# Altium project HAGateWay202205V10.PrjPcb (part 1 of 2)
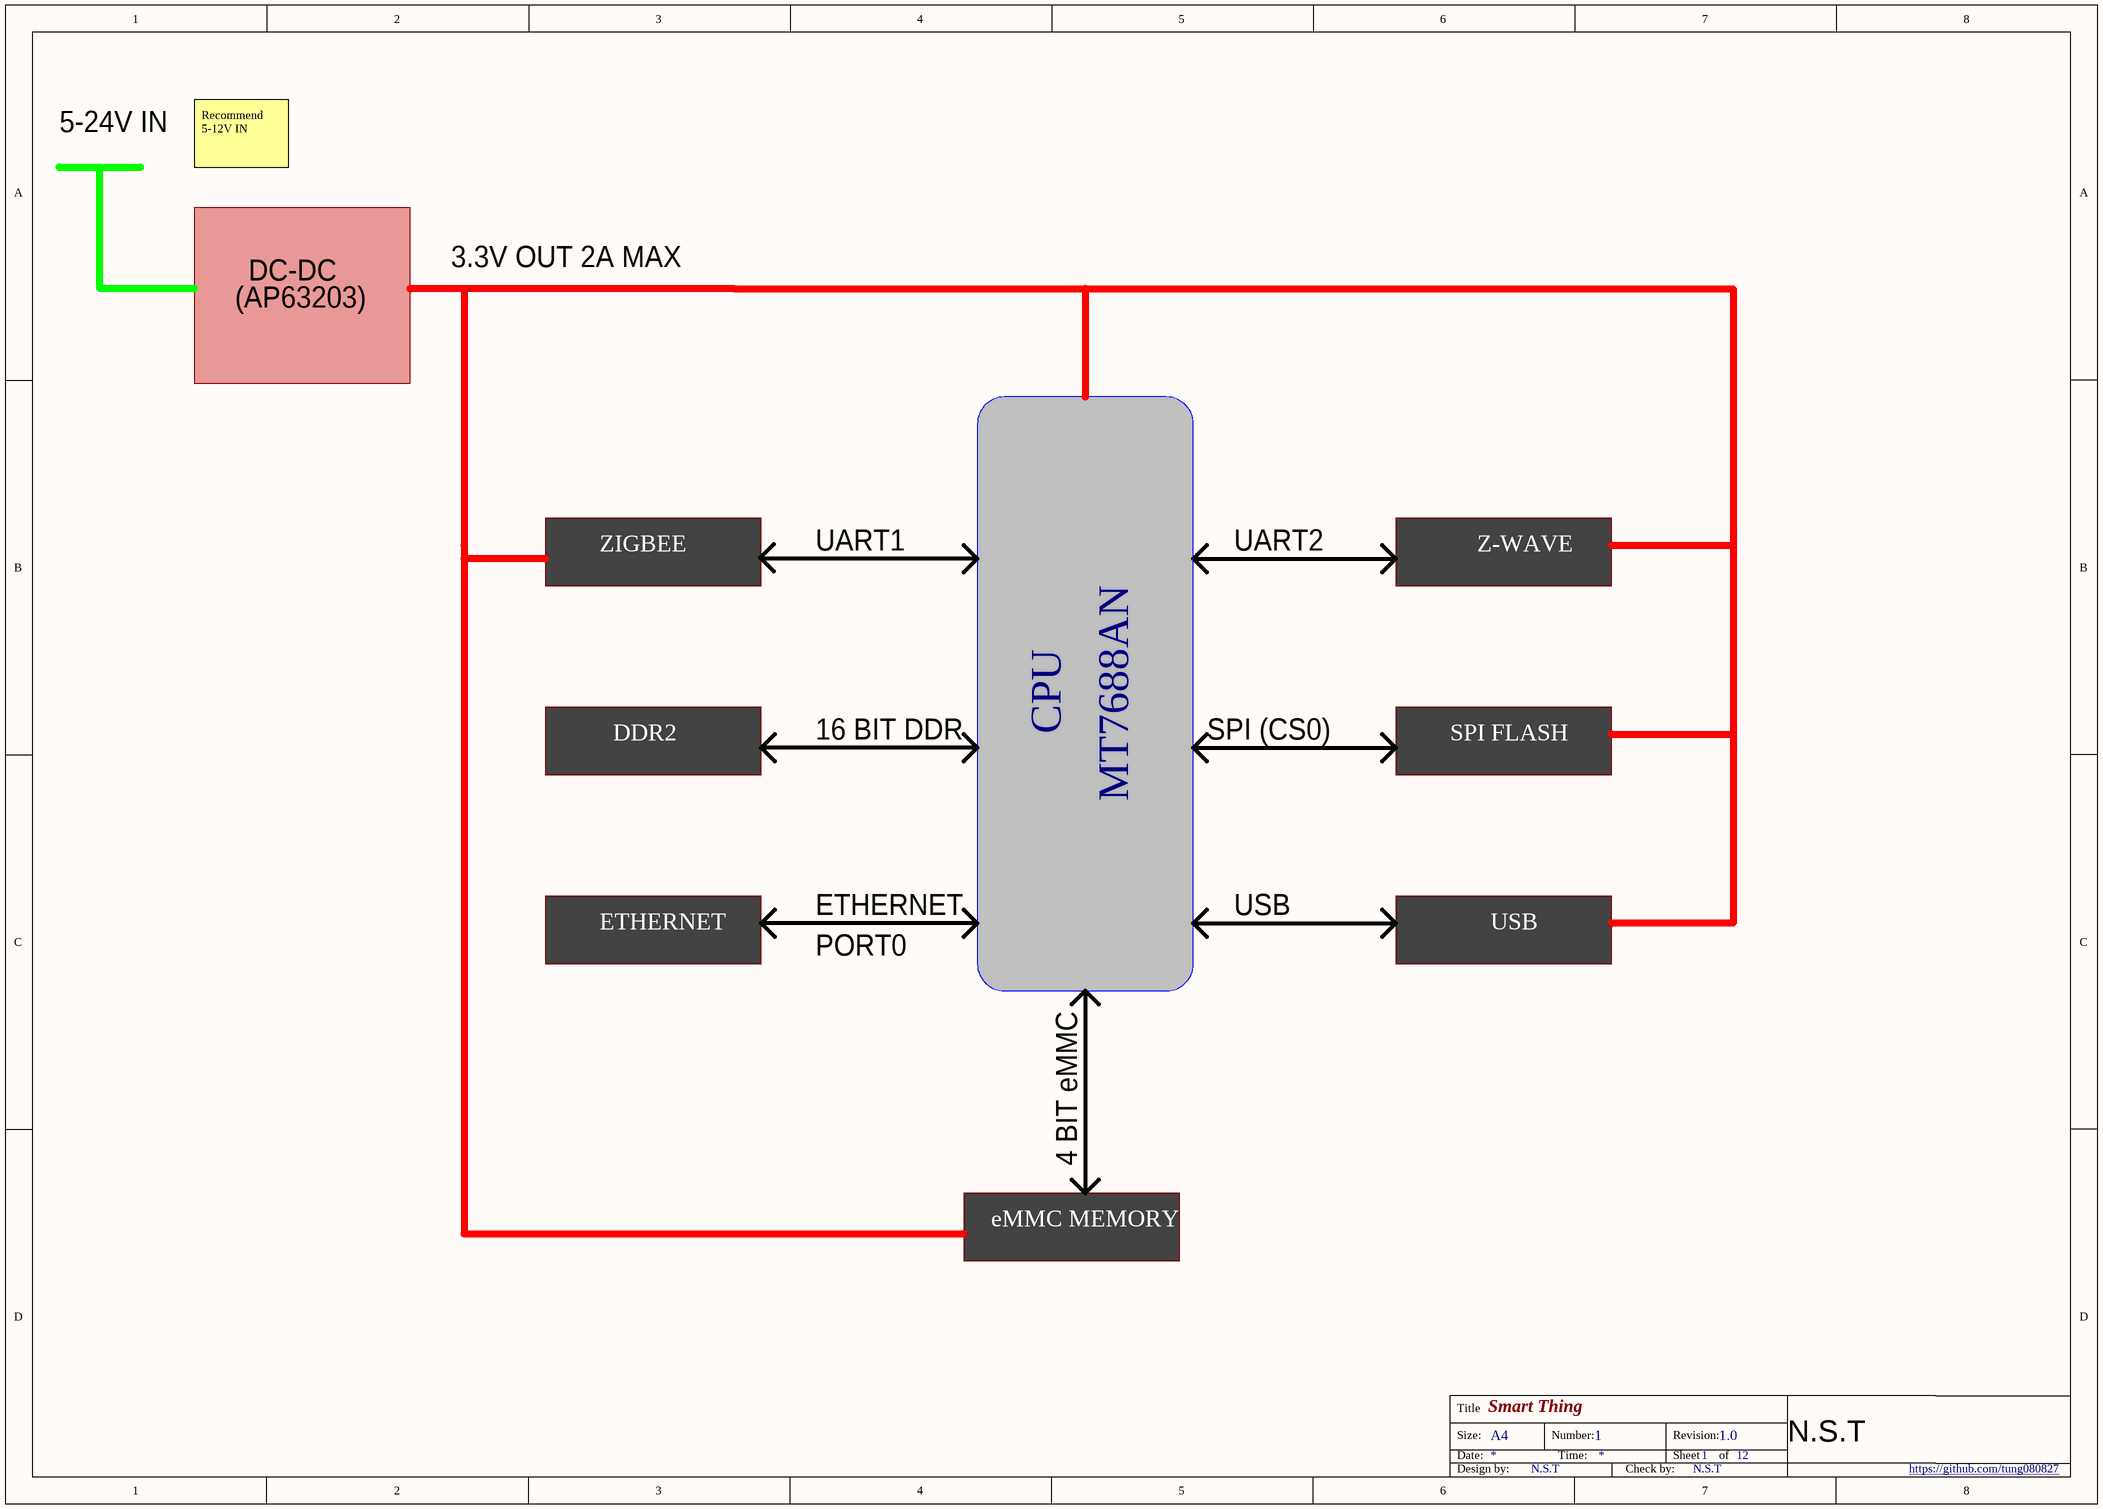
[diagram p0: 01. MAIN.SchDoc]
CheckPerson: N.S.T; DesignPerson: N.S.T; name: Smart Thing; Version: 1.0
12 sheets, 257 parts. Net scope: global (net labels, ports and power ports of the same name join across sheets).
Board file: HAGW202205V10.PcbDoc
Sheets:
  01. MAIN.SchDoc
  02. POWER.SchDoc
  03. ZIGBEE.SchDoc
  04. Z-WAVE.SchDoc
  06. ETHERNET.SchDoc
  05. eMMC.SchDoc
  07. MT7688AN RF Front End.SchDoc
  08. MT7688AN DDR2.SchDoc
  09. MT7688AN Peripheral.SchDoc
  10. MT7688AN USB-PCIe.SchDoc
  11. MT7688AN Ethernet.SchDoc
  12. MT7688AN Power.SchDoc

## Sheet 01. MAIN.SchDoc
size A3; DocumentNumber: 1; SheetNumber: 1; SheetTotal: 12

### Notes on the sheet
- 5-24V IN
- Recommend 5-12V IN
- (AP63203)
- DC-DC
- 3.3V OUT 2A MAX
- ZIGBEE
- UART1
- UART2
- Z-WAVE
- DDR2
- 16 BIT DDR
- CPU
- SPI (CS0)
- SPI FLASH
- MT7688AN
- ETHERNET
- USB
- PORT0
- 4 BIT eMMC
- eMMC MEMORY
- Title
- Size:
- Date:
- A4
- Number:
- Time:
- Revision:
- Sheet
- of
- N.S.T
- Design by:
- Check by:
- https://github.com/tung080827

## Sheet 02. POWER.SchDoc
size A4; DocumentNumber: 2; SheetNumber: 2; SheetTotal: 12
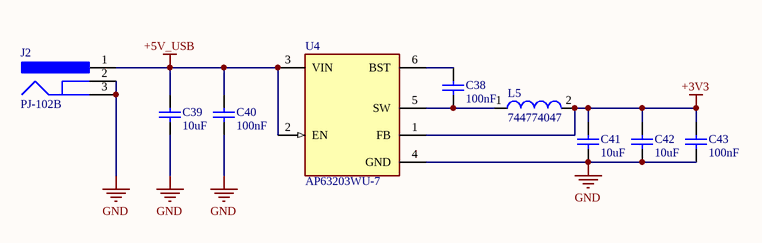
[diagram p1: 02. POWER.SchDoc]

### Parts
C38  100nF  [CAPC1005X56X25NL10T15]
C39  10uF  [CAPC1608X90X35NL10T15]
C40  100nF  [CAPC1005X56X25NL10T15]
C41  10uF  [CAPC1608X90X35NL10T15]
C42  10uF  [CAPC1608X90X35NL10T15]
C43  100nF  [CAPC1005X56X25NL10T15]
J2  PJ-102B  [CUI-PJ-102B_V]
L5  744774047  [WE-PD2-M]
U4  AP63203WU-7  [FP-TSOT26-IPC_B]

### Nets
+3V3: C41.2 C42.2 C43.2 L5.2 U4.1(FB)
+5V_USB: C39.2 C40.2 J2.1 U4.2(EN) U4.3(VIN)
GND: C39.1 C40.1 C41.1 C42.1 C43.1 J2.2 J2.3 U4.4(GND)
NetC38_1: C38.1 L5.1 U4.5(SW)
NetC38_2: C38.2 U4.6(BST)

### Notes on the sheet
- Title
- Size:
- Date:
- A4
- Number:
- Time:
- Revision:
- Sheet
- of
- N.S.T
- Design by:
- Check by:
- https://github.com/tung080827

### Library data of the parts
C38 C40 C43 = CMP-2008-02743-1: Manufacturer: AVX Interconnect / Elco; Part Number: 04026D104KAT2A
C39 C41 C42 = CMP-2006-02354-1: Manufacturer: Murata; Part Number: GCM188R70J225KE22D
J2 = CMP-2000-06900-1: Through Hole Right Angle DC Power Jack, 2.5 A, 2.5 mm Center Pin, 3 Position, -25 to 85 degC, RoHS, Bulk; Manufacturer: CUIInc.; Insulation Resistance: 100MOhms; Inside Contact Diameter: 2.5mm; Outside Contact Diameter: 6.5mm; Voltage Rating: 24V; Current Rating: 2.5A; Brand: CUI; Datasheet URL: http://www.cui.com/product/resource/pj-102b.pdf; Housing Material: PolybutyleneTerephthalate(PBT); Operating Temperature Range: -25Cto+85C; Package Reference: PJ-102B; Factory Pack Quantity: 280; RoHS: True; Contact Material: Copper; Datasheet Version: Rev. 1.03, 04/2016; Product: Jacks; Mounting Angle: Right; Mounting Style: ThroughHole; Flammability Rating: UL94V-0; Product Category: DCPowerConnectors; Contact Gender: Male; Termination Style: ThroughHole; Manufacturer URL: http://www.cui.com/; Mounting Technology: ThroughHole; Package Description: 3-Pin Through Hole Device, Body 14.4 x 9 mm, Height 11 mm; Contact Plating: Nickel; Packaging: Bulk; Connector Type: DCPowerJack
L5 = CMP-0227-00442-1: SMD Power Inductor WE-PD2, L = 4.70 µH; Inductance: 4.70 ÂµH; PackageVersion: 2005; PackageDescription: SMD Inductor, 2-Leads, Body 5.8 x 5.2 mm; ComponentLink2URL: http://www.we-online.de/katalog/media/pdf/744774047.pdf; ComponentLink1Description: Manufacturer Link; PackageReference: WE-PD2-M; DatasheetVersion: ver 2, Jun-2005; ComponentLink1URL: http://www.we-online.com; ComponentLink2Description: Datasheet
U4 = CMP-12757-000006-1: IC REG BUCK 3.3V 2A TSOT26; Manufacturer: Diodes Inc.; Output Type: Fixed; Min Supply Voltage: 3.8V; Number Of Outputs: 1; Max Junction Temp: +160°C; Nominal Supply Current: 22uA; Standoff Height: 0.01mm; Switching Frequency: 1.1MHz; Max Supply Voltage: 32V; ComponentLink2Description: Datasheet; Device Class L1: Integrated Circuits (ICs); Temperature: to +160°C; Device Class L3: Voltage Regulators - Switching; RoHS: TRUE; Octopart: https://octopart.com/ap63203wu-7-diodes+inc.-98099550; Output Voltage: 3.3V; Lead Free: Yes; ComponentLink2URL: https://www.diodes.com/assets/Datasheets/AP63200-AP63201-AP63203-AP63205.pdf; Digikey Description: IC REG BUCK 3.3V 2A TSOT26; Footprint Url: https://www.diodes.com/assets/Package-Files/TSOT26.pdf; Ambient Temperature Range High: +85°C; Height: 1mm; Automotive: No; Temperature Range High: +160°C; Switching Topology: Buck; Output Current: 2A; Package: TSOT26; Category: IC; Mouser Description: AP63203 Series 3.3 V 2 A SMT Fixed Low IQ Synchronous Buck - TSOT-26; Device Class L2: Power Management ICs; Ambient Temperature Range Low: -40°C; Manufacturer Part Number: AP63203WU-7

## Sheet 03. ZIGBEE.SchDoc
size A3; DocumentNumber: 3; SheetNumber: 3; SheetTotal: 12
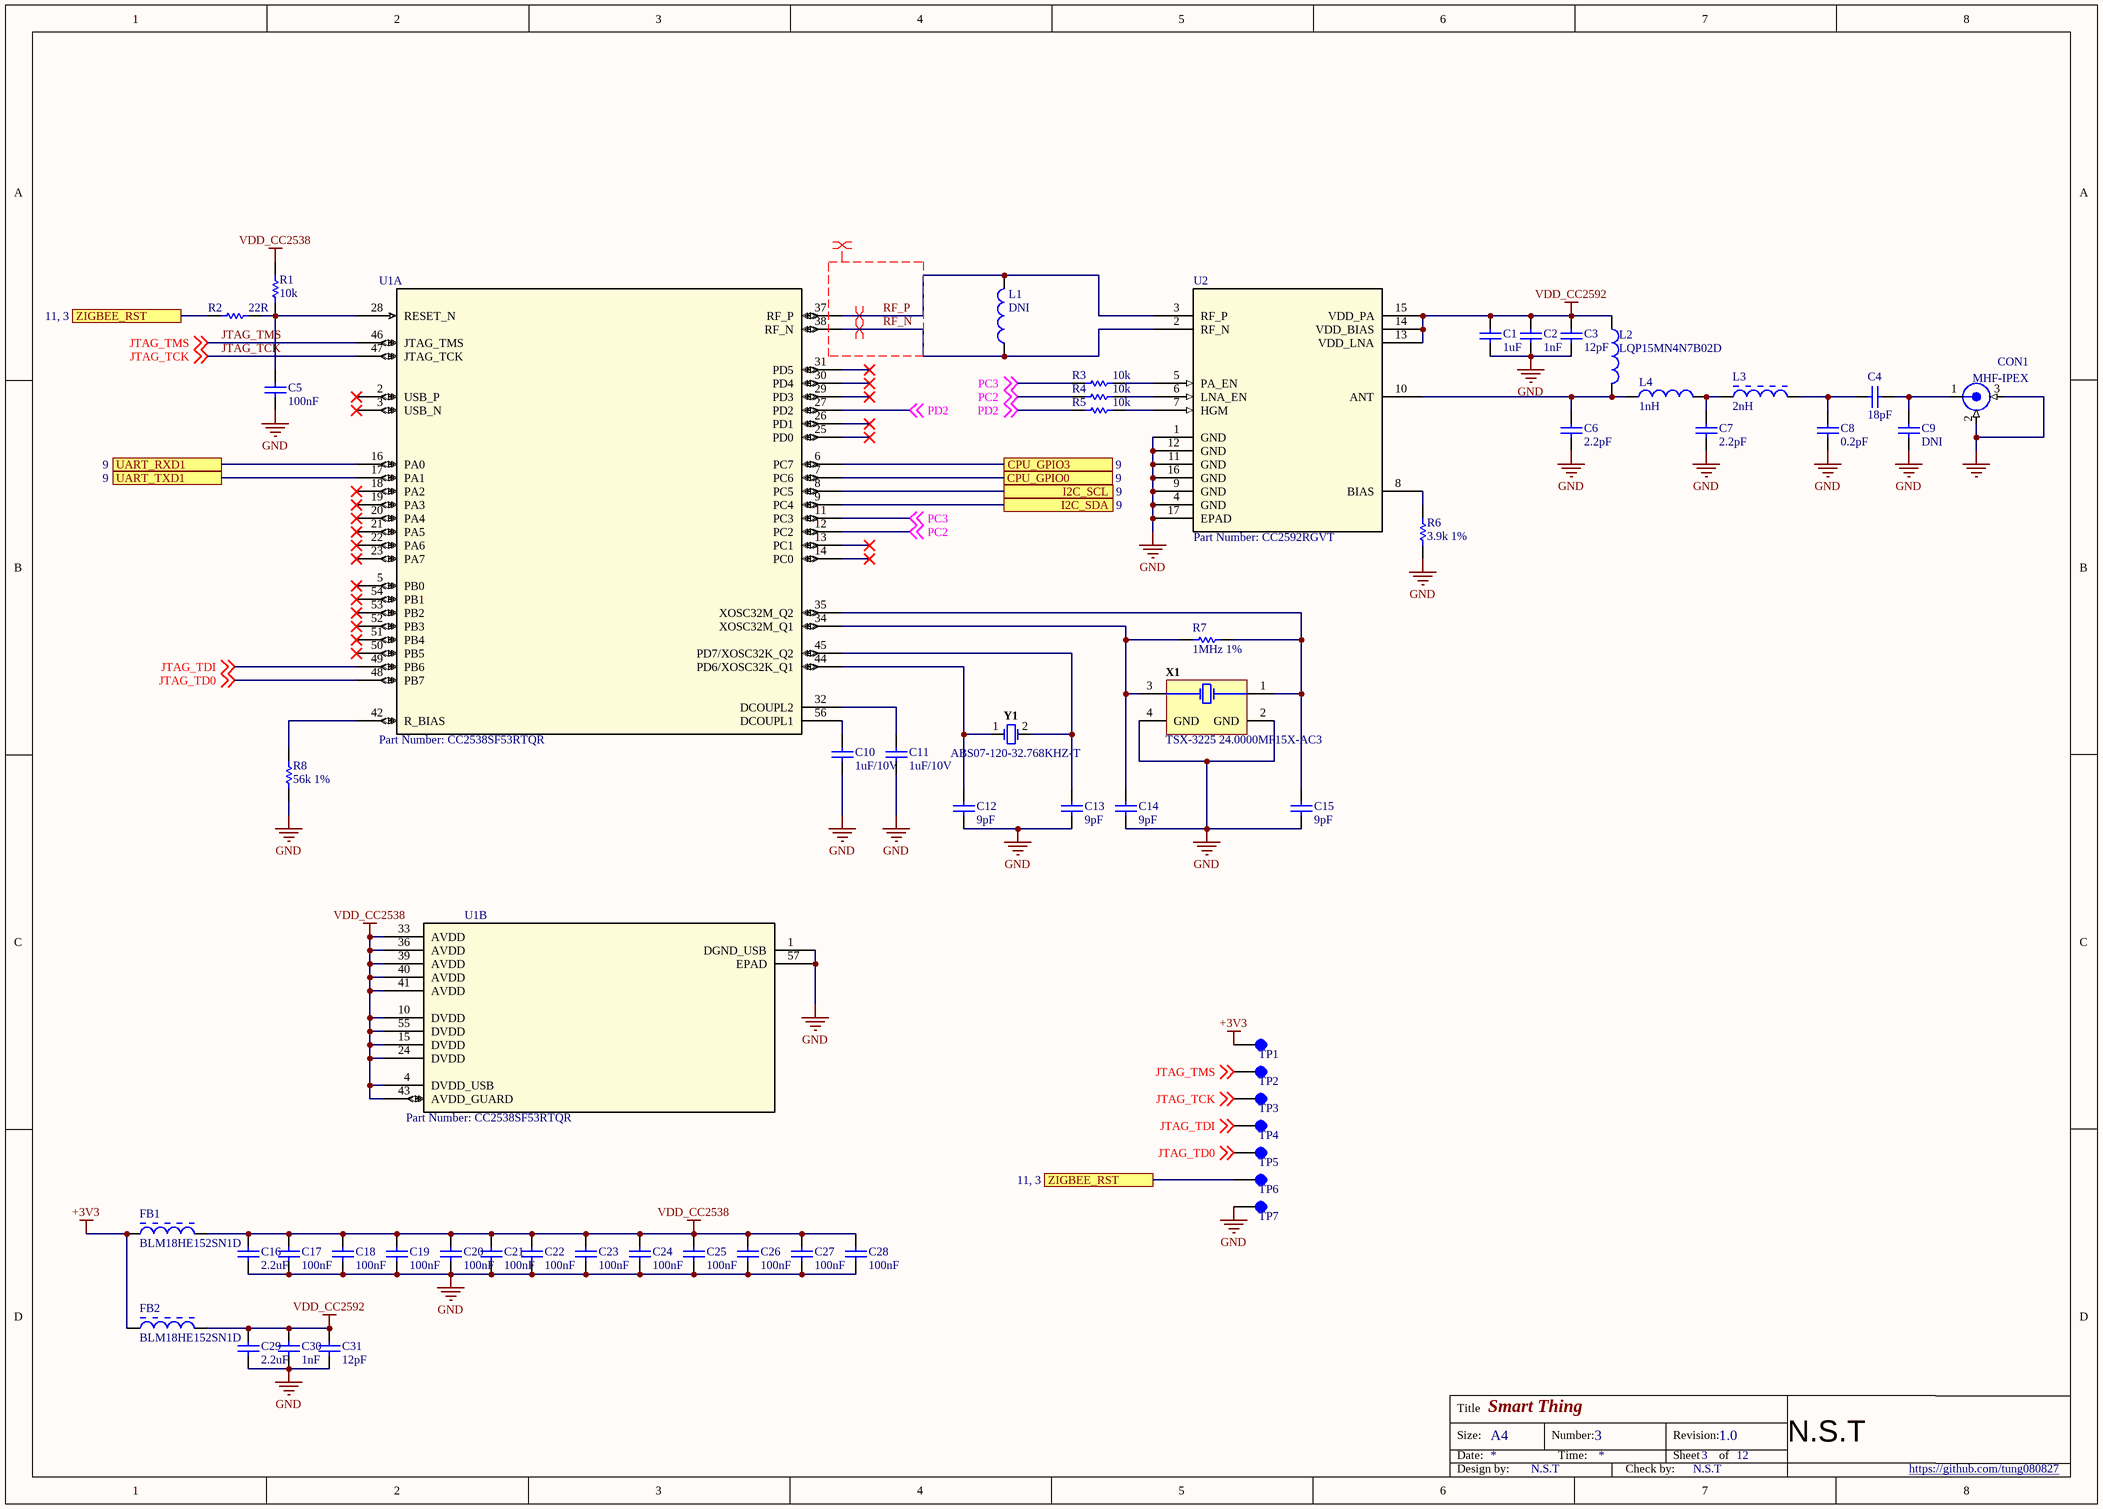
[diagram p2: 03. ZIGBEE.SchDoc]

### Parts
C1  1uF  [CAPC1608X90X20NL10]
C2  1nF  [CAPC1005X55X25NL05T10]
C3  12pF  [CAPC1005X55X25NL05T10]
C4  18pF  [CAPC1005X55X25NL05T10]
C5  100nF  [CAPC1005X56X25NL10T15]
C6  2.2pF  [CAPC1005X55X25NL05T10]
C7  2.2pF  [CAPC1005X55X25NL05T10]
C8  0.2pF  [CAPC1005X55X25NL05T10]
C9  DNI  [CAPC1005X55X25NL05T10]
C10  1uF/10V  [CAPC1005X55X25NL05T10]
C11  1uF/10V  [CAPC1005X55X25NL05T10]
C12  9pF  [CAPC1005X55X25NL05T10]
C13  9pF  [CAPC1005X55X25NL05T10]
C14  9pF  [CAPC1005X55X25NL05T10]
C15  9pF  [CAPC1005X55X25NL05T10]
C16  2.2uF  [CAPC1608X90X35NL10T15]
C17  100nF  [CAPC1005X56X25NL10T15]
C18  100nF  [CAPC1005X56X25NL10T15]
C19  100nF  [CAPC1005X56X25NL10T15]
C20  100nF  [CAPC1005X56X25NL10T15]
C21  100nF  [CAPC1005X56X25NL10T15]
C22  100nF  [CAPC1005X56X25NL10T15]
C23  100nF  [CAPC1005X56X25NL10T15]
C24  100nF  [CAPC1005X56X25NL10T15]
C25  100nF  [CAPC1005X56X25NL10T15]
C26  100nF  [CAPC1005X56X25NL10T15]
C27  100nF  [CAPC1005X56X25NL10T15]
C28  100nF  [CAPC1005X56X25NL10T15]
C29  2.2uF  [CAPC1608X90X35NL10T15]
C30  1nF  [CAPC1005X55X25NL05T10]
C31  12pF  [CAPC1005X55X25NL05T10]
CON1  MHF-IPEX  [I-PEX CON]
FB1  BLM18HE152SN1D  [MURA-BLM18-RF-H4-CHIP-2_V]
FB2  BLM18HE152SN1D  [MURA-BLM18-RF-H4-CHIP-2_V]
L1  DNI  [INDC1005X45X25NL10T10]
L2  LQP15MN4N7B02D  [INDC1005X45X25LL10T10]
L3  2nH  [MURA-IND0402_V]
L4  1nH  [INDC1005X45X25NL10T10]
R1  10k  [RESC1005X40X25NL05T05]
R2  22R  [RESC1005X40X25LL05T05]
R3  10k  [RESC1005X40X25NL05T05]
R4  10k  [RESC1005X40X25NL05T05]
R5  10k  [RESC1005X40X25NL05T05]
R6  3.9k 1%  [RESC1005X40X25NL05T05]
R7  1MHz 1%  [RESC1005X40X25NL05T05]
R8  56k 1%  [RESC1005X40X25NL05T05]
TP1  Test Point  [TP]  (value not drawn)
TP2  Test Point  [TP]  (value not drawn)
TP3  Test Point  [TP]  (value not drawn)
TP4  Test Point  [TP]  (value not drawn)
TP5  Test Point  [TP]  (value not drawn)
TP6  Test Point  [TP]  (value not drawn)
TP7  Test Point  [TP]  (value not drawn)
U1  Part Number: CC2538SF53RTQR  [QFN56_6P7X6P7]  (parts A,B of 2)
U2  Part Number: CC2592RGVT  [QFN16_2P16X2P16]
X1  TSX-3225 24.0000MF15X-AC3  [FP-NX3225SA-MFG]
Y1  ABS07-120-32.768KHZ-T  [ABRA-ABS07_A_V]

### Ports
CPU_GPIO0 (see 9), CPU_GPIO3 (see 9), I2C_SCL (see 9), I2C_SDA (see 9), UART_RXD1 (see 9), UART_TXD1 (see 9), ZIGBEE_RST (see 11, 3)

### Nets
+3V3: FB1.1 FB2.1 TP1.1
GND: C1.1 C2.1 C3.1 C5.1 C6.1 C7.1 C8.1 C9.1 C10.1 C11.1 C12.1 C13.1 C14.1 C15.1 C16.1 C17.1 C18.1 C19.1 C20.1 C21.1 C22.1 C23.1 C24.1 C25.1 C26.1 C27.1 C28.1 C29.1 C30.1 C31.1 CON1.2 CON1.3(GNDA) R6.1 R8.1 TP7.1 U1.1(DGND_USB) U1.57(EPAD) U2.1(GND) U2.4(GND) U2.9(GND) U2.11(GND) U2.12(GND) U2.16(GND) U2.17(EPAD) X1.2(GND) X1.4(GND)
VDD_CC2538: C16.2 C17.2 C18.2 C19.2 C20.2 C21.2 C22.2 C23.2 C24.2 C25.2 C26.2 C27.2 C28.2 FB1.2 R1.2 U1.4(DVDD_USB) U1.10(DVDD) U1.15(DVDD) U1.24(DVDD) U1.33(AVDD) U1.36(AVDD) U1.39(AVDD) U1.40(AVDD) U1.41(AVDD) U1.43(AVDD_GUARD) U1.55(DVDD)
VDD_CC2592: C1.2 C2.2 C3.2 C29.2 C30.2 C31.2 FB2.2 L2.1 U2.13(VDD_LNA) U2.14(VDD_BIAS) U2.15(VDD_PA)
GPIO0 / I2S_SDI: U1.7(PC6) ; port CPU_GPIO0
GPIO3 / I2S_CLK: U1.6(PC7) ; port CPU_GPIO3
GPIO17 / MDI_RN_P1: R2.1 TP6.1 ; port ZIGBEE_RST
JTAG_TCK: TP3.1 U1.47(JTAG_TCK) ; off-sheet JTAG_TCK
JTAG_TD0: TP5.1 U1.48(PB7) ; off-sheet JTAG_TD0
JTAG_TDI: TP4.1 U1.49(PB6) ; off-sheet JTAG_TDI
JTAG_TMS: TP2.1 U1.46(JTAG_TMS) ; off-sheet JTAG_TMS
PC2: R4.1 U1.12(PC2) ; off-sheet PC2
PC3: R3.1 U1.11(PC3) ; off-sheet PC3
PD2: R5.1 U1.27(PD2) ; off-sheet PD2
RF_N: L1.1 U1.38(RF_N) U2.2(RF_N)
RF_P: L1.2 U1.37(RF_P) U2.3(RF_P)
UART_RXD1: U1.16(PA0) ; port UART_RXD1
UART_TXD1: U1.17(PA1) ; port UART_TXD1
NetC4_1: C4.1 C8.2 L3.2
NetC4_2: C4.2 C9.2 CON1.1
NetC5_2: C5.2 R1.1 R2.2 U1.28(RESET_N)
NetC6_2: C6.2 L2.2 L4.1 U2.10(ANT)
NetC7_2: C7.2 L3.1 L4.2
NetC10_2: C10.2 U1.56(DCOUPL1)
NetC11_2: C11.2 U1.32(DCOUPL2)
NetC12_2: C12.2 U1.44(PD6/XOSC32K_Q1) Y1.1
NetC13_2: C13.2 U1.45(PD7/XOSC32K_Q2) Y1.2
NetC14_2: C14.2 R7.1 U1.34(XOSC32M_Q1) X1.3(X2)
NetC15_2: C15.2 R7.2 U1.35(XOSC32M_Q2) X1.1(X1)
NetR3_2: R3.2 U2.5(PA_EN)
NetR4_2: R4.2 U2.6(LNA_EN)
NetR5_2: R5.2 U2.7(HGM)
NetR6_2: R6.2 U2.8(BIAS)
NetR8_2: R8.2 U1.42(R_BIAS)
NetR33_1: U1.8(PC5) ; port I2C_SCL
NetR35_1: U1.9(PC4) ; port I2C_SDA

Not connected (* = marked no-connect by the designer): U1 2(USB_P)* 3(USB_N)* 5(PB0)* 13(PC1)* 14(PC0)* 18(PA2)* 19(PA3)* 20(PA4)* 21(PA5)* 22(PA6)* 23(PA7)* 25(PD0)* 26(PD1)* 29(PD3)* 30(PD4)* 31(PD5)* 50(PB5)* 51(PB4)* 52(PB3)* 53(PB2)* 54(PB1)*

### Layout directives
differential pair: RF_N, RF_P
net class ZIGBEE_RF; rule Matched Net Lengths [Tolerance = 10mil]: RF_N, RF_P

### Notes on the sheet
- Title
- Size:
- Date:
- A4
- Number:
- Time:
- Revision:
- Sheet
- of
- N.S.T
- Design by:
- Check by:
- https://github.com/tung080827

### Library data of the parts
C1 = CMP-2000-06025-1: Chip Capacitor, 1 uF, +/- 10%, 50 V, -55 to 85 degC, 0603 (1608 Metric), RoHS, Tape and Reel; Manufacturer: TDK; PCN Part Number: MLCCPartNumberChange30/Nov/2012; Other Names: 445-7468-6; Online Catalog: CSeries,GeneralPurpose; Capacitance: 1µF; Product Training Modules: CSeriesGeneralApplicationsSEAT,CCV,andTVCLDesignToolsGuidetoReplacinganElectrolyticCapacitorwithanMLCC; Voltage - Rated: 50V; Design Resources: 20WNon-IsolatedBuckLEDDriverUsingPLLNK460KG; Temperature Coefficient: X5R; Series: C; Datasheet Version: 08/2016; Package Description: 2-Pin Surface Mount Device, Body 1.6 x 0.8 mm; Mounting Technology: SurfaceMount; Features: -; Size / Dimension: 0.063"Lx0.031"W(1.60mmx0.80mm); Lead Spacing: -; Operating Temperature: -55°C~85°C; Tolerance: ±10%; Height - Seated (Max): -; Mounting Type: SurfaceMount,MLCC; Ratings: -; Standard Package: 1; Applications: GeneralPurpose; Datasheet URL: https://product.tdk.com/info/en/catalog/datasheets/mlcc_commercial_general_en.pdf; Category: Capacitors; Lead Style: -; Packaging: Digi-Reel®; RoHS Information: RoHSCertificate-MLCC; Package / Case: 0603(1608Metric); Package Reference: 0603; Manufacturer URL: http://www.tdk.com/; Thickness (Max): 0.035"(0.90mm); Family: CeramicCapacitors
C2 C30 = CMP-2008-04254-1: Part Number: GRM1555C1H102JA01D; Manufacturer: Murata
C3 C31 = CMP-2008-03945-1: Part Number: GRM1555C1H120GA01D; Manufacturer: Murata
C4 C9 = CMP-2008-03748-1: Part Number: GJM1555C1H180GB01D; Manufacturer: Murata
C5 C17-C28 = CMP-2008-02743-1: as C38 on sheet 02. POWER
C6 C7 = CMP-2008-03835-1: Part Number: GJM1555C1H2R2BB01D; Manufacturer: Murata
C8 = CMP-2008-03980-1: Part Number: GRM1555C1HR20WA01D; Manufacturer: Murata
C10 C11 = CMP-2008-04556-1: Part Number: GRM155R61A105KE15D; Manufacturer: Murata
C12-C15 = CMP-2008-03890-1: Part Number: GJM1555C1H9R0CB01D; Manufacturer: Murata
C16 C29 = CMP-2006-02354-1: as C39 on sheet 02. POWER
CON1 = SMA/UFLR
FB1 FB2 = CMP-0686-00368-2: Chip Ferrite Bead for GHz Band High-speed Signal Lines, 1500 Ohm, 500 mA, -55 to 125 degC, 1.6 x 0.8 x 0.95 mm SMD, Tape and Reel; Manufacturer: Murata; Rated Current: 500 mA; Impedance (at 100 MHz): 1500 Ohm +/- 25%; DC Resistance: 0.50 Ohm Max.; Packing: Tape and Reel; DatasheetVersion: 08/2013; ComponentLink1URL: http://www.murata.com/; Mounting Technology: Surface Mount; ComponentLink2URL: http://www.murata.com/products/catalog/pdf/c31e.pdf; ComponentLink3Description: Package Specification; ComponentLink2Description: Datasheet; PackageReference: BLM18_H950-2; ComponentLink1Description: Manufacturer URL; PackageDescription: 2-Pin Chip, Body 1.6 x 0.8 mm; ComponentLink3URL: http://www.murata.com/products/catalog/pdf/c31e.pdf; PartNumber: BLM18HE152SN1D; Operating Temperature Range: -55 to 125 degC
L1 = CMP-2000-06590-1: Chip Inductor, 1.8 nH, +/- 0.1 nH, 280 mA, -40 to 85 degC, 0402 (1005 Metric), RoHS, Tape and Reel; Manufacturer: Murata; DC Resistance: 0.2O; Tolerance (nH): ±0.1nH; Rated Current-Max: 280mA; Inductance-Nom: 1.8nH; Manufacturer URL: http://www.murata.com/; Mounting Technology: SurfaceMount; Datasheet URL: http://search.murata.co.jp/Ceramy/image/img/PDF/ENG/L0075S0084LQP15M.pdf; Datasheet Version: 09/2010; Package Reference: 0402; Case Size/Dimension: 0402; Package Description: 2-Pin Surface Mount Device, Body 1 x 0.5 mm
L2 = CMP-2000-06592-1: Chip Inductor, 4.7 nH, +/- 0.1 nH, 160 mA, -40 to 85 degC, 0402 (1005 Metric), RoHS, Tape and Reel; Manufacturer: Murata; Maximum DC Resistance: 600mOhm; Type: RFChip; Inductance: 4.7nH; Product Height: 0.45mm; Maximum DC Current: 160mA; Minimum Quality Factor: 13@500MHz; Rad Hard: No; Tolerance: 0.1nH; Product Depth: 0.6mm; Package Description: 2-Pin Surface Mount Device, Body 1 x 0.5 mm; Package Reference: 0402; Datasheet Version: 09/2010; Packaging: Tape&Reel; Manufacturer URL: http://www.murata.com/; Package/Case: 0402; Datasheet URL: http://search.murata.co.jp/Ceramy/image/img/PDF/ENG/L0075S0084LQP15M.pdf; Mounting Technology: SurfaceMount
L3 = CMP-0499-00001-3: Chip Inductor (Chip Coil) for High Frequency Multilayer, 2 +/- 0.3 nH, 300 mA, 0402 (1005), 180mm Paper Tape; Manufacturer: Murata; PartNumber: LQG15HS2N0S02D; Self Resonance Frequency (min.): 6000 MHz; Inductance Test Frequency: 100 MHz; Inductance: 2.0 nH +/- 0.3 nH; Rated Current (Itemp) (Based on Temperature rise): 300 mA; Max. Of DC Resistance: 0.1 ohm; Q (min.): 8; Operating Temperature Range: -55 to 125 degC; Mounting Technology: Surface Mount; PackageDescription: 2-Pin SMT Inductor, 1 x 0.5 mm Body; ComponentLink2URL: http://search.murata.co.jp/Ceramy/image/img/PDF/ENG/L0075S0083LQG15HS.pdf; ComponentLink1Description: Manufacturer URL; ComponentLink3URL: http://search.murata.co.jp/Ceramy/image/img/PDF/ENG/L0075S0083LQG15HS.pdf; ComponentLink1URL: http://www.murata.com/; ComponentLink2Description: Datasheet; RoHS: Yes; ComponentLink3Description: Package Specification; Q Test Frequency: 100 MHz; PackageReference: IND0402
L4 = CMP-1662-00009-1: Chip Inductor, 1 nH, +/- 0.1 nH, 400 mA, -40 to 85 degC, 0402 (1005 Metric), RoHS, Tape and Reel; PartNumber: LQP15MN1N0B02D; Height: 0.35 mm; Mounting Technology: Surface Mount; Radiation Hardening: No; Max Operating Temperature: 85 degC; Package Quantity: 10000; ComponentLink2Description: Datasheet; ComponentLink2URL: https://www.modelithics.com/models/Vendor/MuRata/LQP15M.pdf; RoHSCompliant: True; ComponentLink1Description: Manufacturer URL; Mount: Surface Mount; Width: 0.5 mm; Min Operating Temperature: -40 degC; Length: 1 mm; ComponentLink1URL: http://www.murata.com/; DatasheetVersion: 09/2010; PackageDescription: 2-Pin Surface Mount Device, Body 1 x 0.5 mm; Case/Package: 0402; Packaging: Tape and Reel
R1 R3-R5 = CMP-2002-08135-1: Manufacturer: Vishay Dale; Part Number: CRCW040210K0FKED
R2 = CMP-1665-00027-3: Chip Resistor, 22 Ohm, +/- 1%, 0.1 W, -55 to 155 degC, 0402 (1005 Metric), RoHS, Tape and Reel; PartNumber: ERJ-2RKF22R0X; Case\/Package: 0402; Resistance: 22 Ohm; Power Rating: 100 mW; Voltage Rating: 50 V; ComponentLink2Description: Datasheet; Packaging: Tape and Reel; Weight: 2.8E-05oz; Pins: 2; Case Code (Imperial): 0402; Width: 0.5 mm; ComponentLink2URL: http://industrial.panasonic.com/cdbs/www-data/pdf/RDA0000/AOA0000C86.pdf; Height: 0.35 mm; PackageReference: 0402; REACH SVHC: Yes; Min Operating Temperature: -55 degC; Length: 1 mm; DatasheetVersion: 04/2015; RoHSCompliant: true; Package Quantity: 10000; Case Code (Metric): 1005; PackageDescription: 2-Pin Surface Mount Device, Body 1 x 0.5 mm; ComponentLink1URL: http://www.panasonic.com/; Mount: Surface Mount; Mounting Technology: Surface Mount; Tolerance: 1%; Max Operating Temperature: 155 degC; ComponentLink1Description: Manufacturer URL
R6 = CMP-2002-08592-1: Manufacturer: Vishay Dale; Part Number: CRCW04023K90FKED
R7 = CMP-2002-08122-1: Part Number: CRCW04020000Z0ED; Manufacturer: Vishay Dale
R8 = CMP-2002-00101-1: Part Number: CRCW040256K0FKED; Manufacturer: Vishay Dale
TP1-TP7 = TP
U1 = CC2538SF53RTQR: IC RF TxRx + MCU 802.15.4 6LoWPAN, Zigbee® 2.4GHz 56-VFQFN Exposed Pad; Vendor: Texas Instruments; Built_By: EMA_UL_Team; Manufacturer_Part_Number: CC2538SF53RTQR; Copyright: Copyright (C) 2018 Accelerated Designs. All rights reserved; RefDes: RefDes; Type: DEV; Value: Value
U2 = CC2592RGVT: No Description Available; Vendor: Texas Instruments; Built_By: EMA_UL_Team; Manufacturer_Part_Number: CC2592RGVT; Copyright: Copyright (C) 2018 Accelerated Designs. All rights reserved; RefDes: RefDes; Type: DEV; Value: Value
X1 = CMP-2000-07333-1: MHz Range Crystal, 24 MHz, -40 to 85 degC, 4-Pin SMD, RoHS, Tape and Reel; Manufacturer: Epson; Brand: EpsonTiming; Frequency Stability: 10PPM; Frequency: 24MHz; ESR: 40Ohms; Load Capacitance: 9pF; Unit Weight: 0.000564oz; Drive Level: 200uW; Datasheet Version: 12/2015; RoHS: True; Operating Temperature Range: -40Cto+85C; Length: 3.2mm; Tolerance: 10PPM; Width: 2.5mm; Mounting Technology: SurfaceMount; Package Description: 4-Pin Surface Mount Device, Body 3.2 x 2.5 mm; Manufacturer URL: https://www.eea.epson.com/; Factory Pack Quantity: 250; Package Reference: TSX-3225; Height: 0.6mm; Mounting Style: SMD/SMT; Termination Style: SMD/SMT; Datasheet URL: https://support.epson.biz/td/api/doc_check.php?dl=brief_FA-238V_en.pdf; Type: Crystal; Series: TSX-3225; Package / Case: 3.2mmx2.5mm; Product Category: Crystals; Packaging: Reel
Y1 = CMP-2000-07587-1: Tuning Fork Crystal, 32.768 KHz, +/- 20 ppm, -40 to 85 degC, 2-Pin SMD, RoHS, Tape and Reel; Manufacturer: Abracon; Case\/Package: SMD/SMT; Series Resistance: 60KOhm; Frequency Tolerance: 20ppm; Load Capacitance: 6pF; ESR (Equivalent Series Resistance): 55KOhm; Max Operating Temperature: 85degC; Width: 0.061inch; Radiation Hardening: No; Lead Free: LeadFree; RoHSCompliant: True; Depth: 1.5mm; Datasheet URL: http://www.abracon.com/Resonators/ABS07-120-32.768kHz-T.pdf; Frequency: 32.768KHz; Termination: SMD/SMT; Manufacturer URL: http://www.abracon.com/; Package Quantity: 3000; Packaging: TapeandReel; Number of Pins: 2; Height: 0.035inch; Package Description: 2-Pin Surface Mount Device, Body 3.2 x 1.5 mm; Package Reference: ABS07; Mount: SurfaceMount; Tolerance: 20ppm; Mounting Technology: SurfaceMount; REACH SVHC: NoSVHC; Datasheet Version: 11/2014; Length: 3.2mm; Min Operating Temperature: -40degC

## Sheet 04. Z-WAVE.SchDoc
size A4; DocumentNumber: 4; SheetNumber: 4; SheetTotal: 12
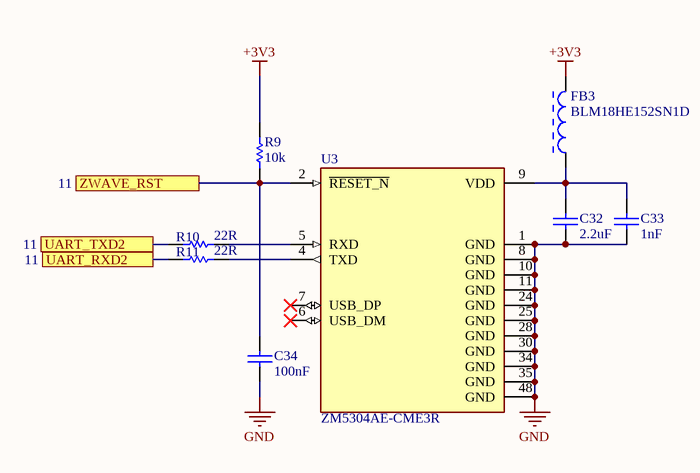
[diagram p3: 04. Z-WAVE.SchDoc]

### Parts
C32  2.2uF  [CAPC1608X90X35NL10T15]
C33  1nF  [CAPC1005X55X25NL05T10]
C34  100nF  [CAPC1005X56X25NL10T15]
FB3  BLM18HE152SN1D  [MURA-BLM18-RF-H4-CHIP-2_V]
R9  10k  [RESC1005X40X25NL05T05]
R10  22R  [RESC1005X40X25NL05T05]
R11  22R  [RESC1005X40X25NL05T05]
U3  ZM5304AE-CME3R  [ZM5304AE-CME3]

### Ports
UART_RXD2 (see 11), UART_TXD2 (see 11), ZWAVE_RST (see 11)

### Nets
+3V3: FB3.2 R9.2
GND: C32.1 C33.1 C34.1 U3.1(GND) U3.8(GND) U3.10(GND) U3.11(GND) U3.24(GND) U3.25(GND) U3.28(GND) U3.30(GND) U3.34(GND) U3.35(GND) U3.48(GND)
GPIO16 / MDI_RP_P1: C34.2 R9.1 U3.2(~{RESET_N}) ; port ZWAVE_RST
UART_RXD2: R11.2 ; port UART_RXD2
UART_TXD2: R10.2 ; port UART_TXD2
NetC32_2: C32.2 C33.2 FB3.1 U3.9(VDD)
NetR10_1: R10.1 U3.5(RXD)
NetR11_1: R11.1 U3.4(TXD)

Not connected (* = marked no-connect by the designer): U3 6(USB_DM)* 7(USB_DP)*

### Notes on the sheet
- Title
- Size:
- Date:
- A4
- Number:
- Time:
- Revision:
- Sheet
- of
- N.S.T
- Design by:
- Check by:
- https://github.com/tung080827

### Library data of the parts
C32 = CMP-2006-02354-1: as C39 on sheet 02. POWER
C33 = CMP-2008-04254-1: as C2 on sheet 03. ZIGBEE
C34 = CMP-2008-02743-1: as C38 on sheet 02. POWER
FB3 = CMP-0686-00368-2: as FB1 on sheet 03. ZIGBEE; Packing: Tape and Reel; DatasheetVersion: 08/2013; ComponentLink1URL: http://www.murata.com/; Mounting Technology: Surface Mount; ComponentLink2URL: http://www.murata.com/products/catalog/pdf/c31e.pdf; ComponentLink3Description: Package Specification; ComponentLink2Description: Datasheet; PackageReference: BLM18_H950-2; ComponentLink1Description: Manufacturer URL; PackageDescription: 2-Pin Chip, Body 1.6 x 0.8 mm; ComponentLink3URL: http://www.murata.com/products/catalog/pdf/c31e.pdf; PartNumber: BLM18HE152SN1D; Operating Temperature Range: -55 to 125 degC
R9-R11 = CMP-2002-08135-1: as R1 on sheet 03. ZIGBEE
U3 = ZM5304AE-CME3R: General ISM < 1GHz Z-WaveÂ® Transceiver Module 868MHz Surface Mount; MF: Silicon Labs; SnapEDA_Link: https://www.snapeda.com/parts/ZM5304AE-CME3R/Silicon%20Labs/view-part/214706/?ref=snap; Digi-Key_Part_Number: 703-1074-1-ND; MP: ZM5304AE-CME3R; Value: *; Package: Module Sigma Designs; Digi-Key_Purchase_URL: https://www.digikey.com/product-detail/en/silicon-labs/ZM5304AE-CME3R/703-1074-1-ND/4135431?utm_source=snapeda&utm_medium=aggregator&utm_campaign=symbol

## Sheet 06. ETHERNET.SchDoc
size A4; DocumentNumber: 5; SheetNumber: 5; SheetTotal: 12
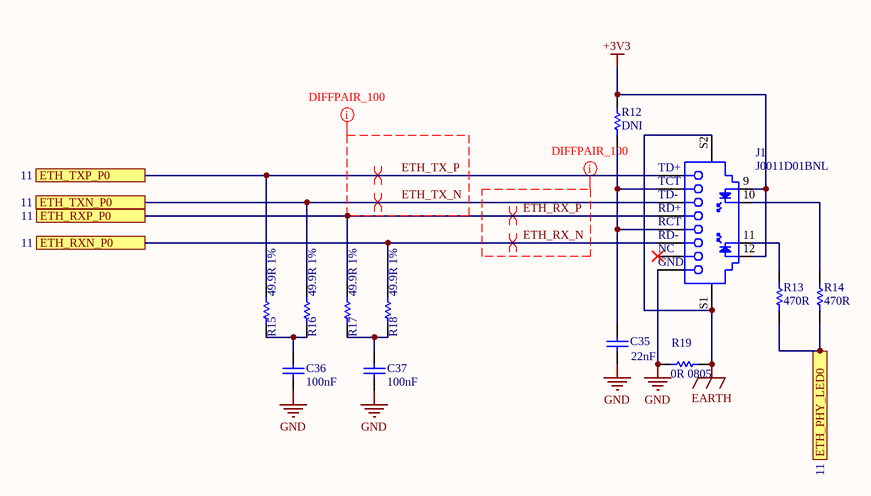
[diagram p4: 06. ETHERNET.SchDoc]

### Parts
C35  22nF  [CAPC1005X60X30LL05T10]
C36  100nF  [CAPC1005X60X30LL05T10]
C37  100nF  [CAPC1005X60X30LL05T10]
J1  J0011D01BNL  [J0011D01BNL 1PORT 100 BASE-TX]
R12  DNI  [RESC1005X40X25LL05T05]
R13  470R  [RESC1005X40X25LL05T05]
R14  470R  [RESC1005X40X25LL05T05]
R15  49.9R 1%  [RESC1005X40X25LL05T05]
R16  49.9R 1%  [RESC1005X40X25LL05T05]
R17  49.9R 1%  [RESC1005X40X25LL05T05]
R18  49.9R 1%  [RESC1005X40X25LL05T05]
R19  0R 0805  [RESC2013X50X30LL20T20]

### Ports
ETH_PHY_LED0 (see 11), ETH_RXN_P0 (see 11), ETH_RXP_P0 (see 11), ETH_TXN_P0 (see 11), ETH_TXP_P0 (see 11)

### Nets
+3V3: J1.9 J1.12 R12.2
EARTH: J1.S1 J1.S2 R19.2
GND: C35.1 C36.1 C37.1 J1.8(GND) R19.1
JTDO: R13.1 R14.1 ; port ETH_PHY_LED0
ETH_RX_N: J1.6(RD-) R18.2 ; port ETH_RXN_P0
ETH_RX_P: J1.4(RD+) R17.2 ; port ETH_RXP_P0
ETH_TX_N: J1.3(TD-) R16.2 ; port ETH_TXN_P0
ETH_TX_P: J1.1(TD+) R15.2 ; port ETH_TXP_P0
NetC35_2: C35.2 J1.2(TCT) J1.5(RCT) R12.1
NetC36_2: C36.2 R15.1 R16.1
NetC37_2: C37.2 R17.1 R18.1
NetJ1_10: J1.10 R14.2
NetJ1_11: J1.11 R13.2

Not connected (* = marked no-connect by the designer): J1 7(NC)*

### Layout directives
differential pair: ETH_RX_N, ETH_RX_P, ETH_TX_N, ETH_TX_P
net class ETHERNET; rule Matched Net Lengths [Tolerance = 10mil]; rule Differential Pairs Routing [Pref Gap = 0.185mm    Min Gap  = 0.1mm    Max Gap  = 0.185mmPref Width = 0.1mm    Min Width  = 0.1mm    Max Width  = 0.1mm]: ETH_RX_N, ETH_RX_P, ETH_TX_N, ETH_TX_P

### Notes on the sheet
- Title
- Size:
- Date:
- A4
- Number:
- Time:
- Revision:
- Sheet
- of
- N.S.T
- Design by:
- Check by:
- https://github.com/tung080827

### Library data of the parts
C35 = CMP-2008-04654-1: Part Number: GRM155R71H223KA12D; Manufacturer: Murata
C36 C37 = CMP-2100-03641-1: Chip Capacitor, 0.1 uF, +/- 10%, 16 V, -55 to 125 degC, 0402 (1005 Metric), RoHS, Tape and Reel; Manufacturer: Murata; Material: Ceramic; Insulation Resistance: 10GR; Voltage: 16V; Dielectric: X7R; REACH SVHC: NoSVHC; Depth: 0.5mm; Case/Package: 0402; Datasheet URL: http://psearch.en.murata.com/capacitor/product/GRM155R71C104KA88%23.pdf; Lead Free: LeadFree; Dielectric Material: Ceramic; Manufacturer URL: http://www.murata.com/; Min Operating Temperature: -55degC; Length: 1mm; Case Code (Metric): 1005; Radiation Hardening: No; Package Reference: 0402; RoHSCompliant: true; Datasheet Version: 42675.0; Thickness: 0.022inch; Packaging: TapeandReel; Voltage Rating (DC): 16V; Tolerance: 10%; Max Operating Temperature: 125degC; Package Description: 2-Pin Surface Mount Device, Body 1 x 0.5 mm; Mount: SurfaceMount; Height: 0.5mm; Width: 0.5mm; Number of Pins: 2; Voltage Rating: 16V; Case Code (Imperial): 0402; Termination: SMD/SMT; Capacitance: 100nF; Package Quantity: 1
J1 = CMP-2000-06492-1: RJ45 Connector, Pitch 1.27 mm, 12 Position, Height 13.84 mm, Tail Length 3.3 mm, 0 to 70 degC, RoHS, Tray; Manufacturer: Pulse Electronics; Dynamic Catalog: PULSEJACK™J0andJ2Series; Shield Material: Brass; Shielding: Shielded; LED Color: Green-Yellow; Number of Ports: 1; Number of Cores per Jack: 4; Catalog Drawings: PULSEJACKRightAngle1x1; Other Names: 553-1483 / J0011D01BNL-ND; Tab Direction: Down; Package Description: RJ45 Connector, Pitch 1.27 mm, 12 Position, Height 13.84 mm, Tail Length 3.3 mm; Number of Rows: 1; Contact Finish Thickness: 15µin(0.38µm); Datasheet URL: http://productfinder.pulseeng.com/products/datasheets/J403.pdf; Connector Type: RJ45; Mounting Type: ThroughHole; Package Reference: J0-A; Orientation: 90°Angle(Right); Termination: Solder; Datasheet Version: Rev. K, 08/2012; Applications: 10/100Base-TX,AutoMDIX; Series: PULSEJACK™J0; Contact Finish: Gold; Height Above Board: 0.545"(13.84mm); Operating Temperature: 0°C~70°C; Packaging: Tray; Contact Material: PhosphorBronze; Standard Package: 30; Housing Material: Thermoplastic; Features: BoardGuide; Category: Connectors,Interconnects; Mounting Technology: ThroughHole; Manufacturer URL: http://www.pulseelectronics.com/; Family: ModularConnectors-JacksWithMagnetics
R12 = CMP-2002-03046-1: Part Number: CRCW040210R0FKEDHP; Manufacturer: Vishay Dale
R13 R14 = CMP-2000-03373-1: Part Number: CRCW0603470RFKEA; Manufacturer: Vishay Dale
R15-R18 = CMP-2002-00969-1: Precision Thick Film Chip Resistors; Manufacturer: Panasonic; Part Number: ERJ-2RKF49R9X
R19 = CMP-2001-04896-1: Manufacturer: Vishay Dale; Part Number: CRCW08050000Z0EA

## Sheet 05. eMMC.SchDoc
size A3; DocumentNumber: 6; SheetNumber: 6; SheetTotal: 12
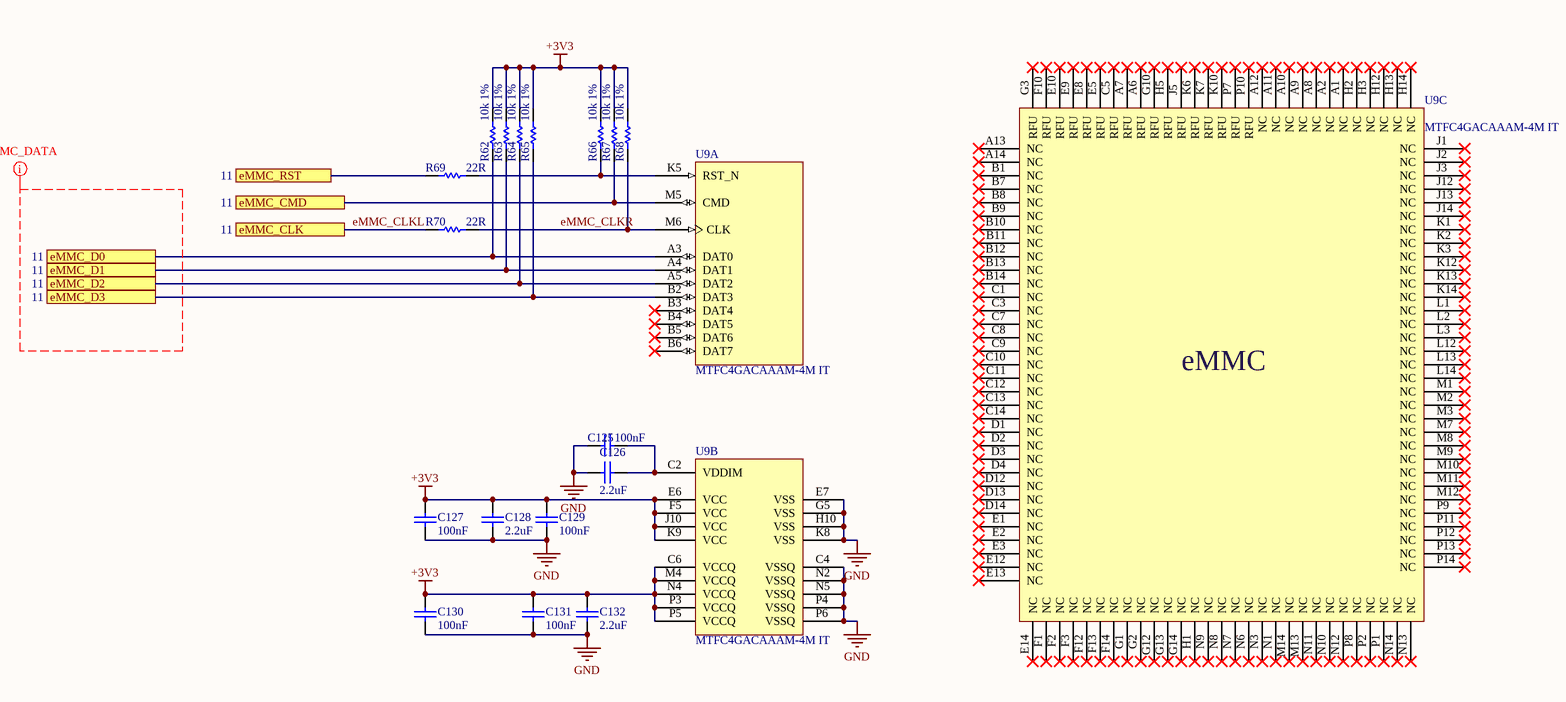
[diagram p5: 05. eMMC.SchDoc]

### Parts
C125  100nF  [CAPC1005X60X30LL05T10]
C126  2.2uF  [CAPC1608X90X35ML10T15]
C127  100nF  [CAPC1005X60X30LL05T10]
C128  2.2uF  [CAPC1005X60X30LL05T10]
C129  100nF  [CAPC1005X60X30LL05T10]
C130  100nF  [CAPC1005X60X30LL05T10]
C131  100nF  [CAPC1005X60X30LL05T10]
C132  2.2uF  [CAPC1608X90X35ML10T15]
R62  10k 1%  [RESC1005X40X25LL05T05]
R63  10k 1%  [RESC1005X40X25LL05T05]
R64  10k 1%  [RESC1005X40X25LL05T05]
R65  10k 1%  [RESC1005X40X25LL05T05]
R66  10k 1%  [RESC1005X40X25LL05T05]
R67  10k 1%  [RESC1005X40X25LL05T05]
R68  10k 1%  [RESC1005X40X25LL05T05]
R69  22R  [RESC1005X40X25LL05T05]
R70  22R  [RESC1005X40X25LL05T05]
U9  MTFC4GACAAAM-4M IT  [VFBGA-153]  (parts A,B,C of 3)

### Ports
eMMC_CLK (see 11), eMMC_CMD (see 11), eMMC_D0 (see 11), eMMC_D1 (see 11), eMMC_D2 (see 11), eMMC_D3 (see 11), eMMC_RST (see 11)

### Nets
+3V3: C127.2 C128.2 C129.2 C130.2 C131.2 C132.2 R62.2 R63.2 R64.2 R65.2 R66.2 R67.2 R68.2 U9.C6(VCCQ) U9.E6(VCC) U9.F5(VCC) U9.J10(VCC) U9.K9(VCC) U9.M4(VCCQ) U9.N4(VCCQ) U9.P3(VCCQ) U9.P5(VCCQ)
GND: C125.2 C126.2 C127.1 C128.1 C129.1 C130.1 C131.1 C132.1 U9.C4(VSSQ) U9.E7(VSS) U9.G5(VSS) U9.H10(VSS) U9.K8(VSS) U9.N2(VSSQ) U9.N5(VSSQ) U9.P4(VSSQ) U9.P6(VSSQ)
eMMC_CLKL: R70.1 ; port eMMC_CLK
eMMC_CLKR: R68.1 R70.2 U9.M6(CLK)
GPIO14 / MDI_TP_P1: R69.1 ; port eMMC_RST
SD_CMD: R67.1 U9.M5(CMD) ; port eMMC_CMD
SD_D0: R62.1 U9.A3(DAT0) ; port eMMC_D0
SD_D1: R63.1 U9.A4(DAT1) ; port eMMC_D1
SD_D2: R64.1 U9.A5(DAT2) ; port eMMC_D2
SD_D3: R65.1 U9.B2(DAT3) ; port eMMC_D3
NetC125_1: C125.1 C126.1 U9.C2(VDDIM)
NetR66_1: R66.1 R69.2 U9.K5(RST_N)

Not connected (* = marked no-connect by the designer): U9 A1(NC)* A2(NC)* A6(RFU)* A7(RFU)* A8(NC)* A9(NC)* A10(NC)* A11(NC)* A12(NC)* A13(NC)* A14(NC)* B1(NC)* B3(DAT4)* B4(DAT5)* B5(DAT6)* B6(DAT7)* B7(NC)* B8(NC)* B9(NC)* B10(NC)* B11(NC)* B12(NC)* B13(NC)* B14(NC)* C1(NC)* C3(NC)* C5(RFU)* C7(NC)* C8(NC)* C9(NC)* C10(NC)* C11(NC)* C12(NC)* C13(NC)* C14(NC)* D1(NC)* D2(NC)* D3(NC)* D4(NC)* D12(NC)* D13(NC)* D14(NC)* E1(NC)* E2(NC)* E3(NC)* E5(RFU)* E8(RFU)* E9(RFU)* E10(RFU)* E12(NC)* E13(NC)* E14(NC)* F1(NC)* F2(NC)* F3(NC)* F10(RFU)* F12(NC)* F13(NC)* F14(NC)* G1(NC)* G2(NC)* G3(RFU)* G10(RFU)* G12(NC)* G13(NC)* G14(NC)* H1(NC)* H2(NC)* H3(NC)* H5(RFU)* H12(NC)* H13(NC)* H14(NC)* J1(NC)* J2(NC)* J3(NC)* J5(RFU)* J12(NC)* J13(NC)* J14(NC)* K1(NC)* K2(NC)* K3(NC)* K6(RFU)* K7(RFU)* K10(RFU)* K12(NC)* K13(NC)* K14(NC)* L1(NC)* L2(NC)* L3(NC)* L12(NC)* L13(NC)* L14(NC)* M1(NC)* M2(NC)* M3(NC)* M7(NC)* M8(NC)* M9(NC)* M10(NC)* M11(NC)* M12(NC)* M13(NC)* M14(NC)* N1(NC)* N3(NC)* N6(NC)* N7(NC)* N8(NC)* N9(NC)* N10(NC)* N11(NC)* N12(NC)* N13(NC)* N14(NC)* P1(NC)* P2(NC)* P7(RFU)* P8(NC)* P9(NC)* P10(RFU)* P11(NC)* P12(NC)* P13(NC)* P14(NC)*

### Layout directives
net class eMMC; rule Matched Net Lengths [Tolerance = 20mil]: (no net found under the mark)

### Notes on the sheet
- Title
- Size:
- Date:
- A4
- Number:
- Time:
- Revision:
- Sheet
- of
- N.S.T
- Design by:
- Check by:
- https://github.com/tung080827
- (in symbol CMP-2000-05234-1, part C) eMMC

### Library data of the parts
C125 C127 C129-C131 = CMP-2100-03641-1: as C36 on sheet 06. ETHERNET; REACH SVHC: NoSVHC; Depth: 0.5mm; Case/Package: 0402; Datasheet URL: http://psearch.en.murata.com/capacitor/product/GRM155R71C104KA88%23.pdf; Lead Free: LeadFree; Dielectric Material: Ceramic; Manufacturer URL: http://www.murata.com/; Min Operating Temperature: -55degC; Length: 1mm; Case Code (Metric): 1005; Radiation Hardening: No; Package Reference: 0402; RoHSCompliant: true; Datasheet Version: 42675.0; Thickness: 0.022inch; Packaging: TapeandReel; Voltage Rating (DC): 16V; Tolerance: 10%; Max Operating Temperature: 125degC; Package Description: 2-Pin Surface Mount Device, Body 1 x 0.5 mm; Mount: SurfaceMount; Height: 0.5mm; Width: 0.5mm; Number of Pins: 2; Voltage Rating: 16V; Case Code (Imperial): 0402; Termination: SMD/SMT; Capacitance: 100nF; Package Quantity: 1
C126 C128 C132 = CMP-2006-02836-1: CAP 2.2uF 10V ±10% 0603 (1608 Metric) Thickness 0.6mm SMD; Manufacturer: Murata; Part Number: GRM188R71A225KE15D
R62-R68 = CMP-2002-08135-1: 10k 0.063W 1% 0402 (1005 Metric)  SMD; Manufacturer: Vishay Dale; Part Number: CRCW040210K0FKED
R69 R70 = CMP-1665-00027-3: as R2 on sheet 03. ZIGBEE; ComponentLink2Description: Datasheet; Packaging: Tape and Reel; Weight: 2.8E-05oz; Pins: 2; Case Code (Imperial): 0402; Width: 0.5 mm; ComponentLink2URL: http://industrial.panasonic.com/cdbs/www-data/pdf/RDA0000/AOA0000C86.pdf; Height: 0.35 mm; PackageReference: 0402; REACH SVHC: Yes; Min Operating Temperature: -55 degC; Length: 1 mm; DatasheetVersion: 04/2015; RoHSCompliant: true; Package Quantity: 10000; Case Code (Metric): 1005; PackageDescription: 2-Pin Surface Mount Device, Body 1 x 0.5 mm; ComponentLink1URL: http://www.panasonic.com/; Mount: Surface Mount; Mounting Technology: Surface Mount; Tolerance: 1%; Max Operating Temperature: 155 degC; ComponentLink1Description: Manufacturer URL
U9 = CMP-2000-05234-1: e·MMC Memory, 4 Gb, 2.7 to 3.6 V, -40 to 85 degC, 153-Ball VFBGA, RoHS; Manufacturer: Micron; Operating Supply Voltage: 3.3V; Max Processing Temp: 260; Lead Finish: Tin|Silver|Copper; Package Reference: VFBGA-153; Package Description: 153-Ball Very Fine Pitch Ball Grid Array, Body 13 x 11.5 mm, Pitch 0.5 mm; Datasheet Version: Rev. E, 06/2014; Operating Temperature: -40to85C; Mounting: SurfaceMount; Manufacturer URL: https://www.micron.com/; Package URL: http://download.siliconexpert.com/pdfs/2015/2/24/1/20/24/252/mic_/manual/emmc_ps8210_v451_80s_153b_it.pdf; Datasheet URL: http://download.siliconexpert.com/pdfs/2015/2/24/1/20/24/252/mic_/manual/emmc_ps8210_v451_80s_153b_it.pdf

## Sheet 07. MT7688AN RF Front End.SchDoc
size A3; DocumentNumber: 7; SheetNumber: 7; SheetTotal: 12
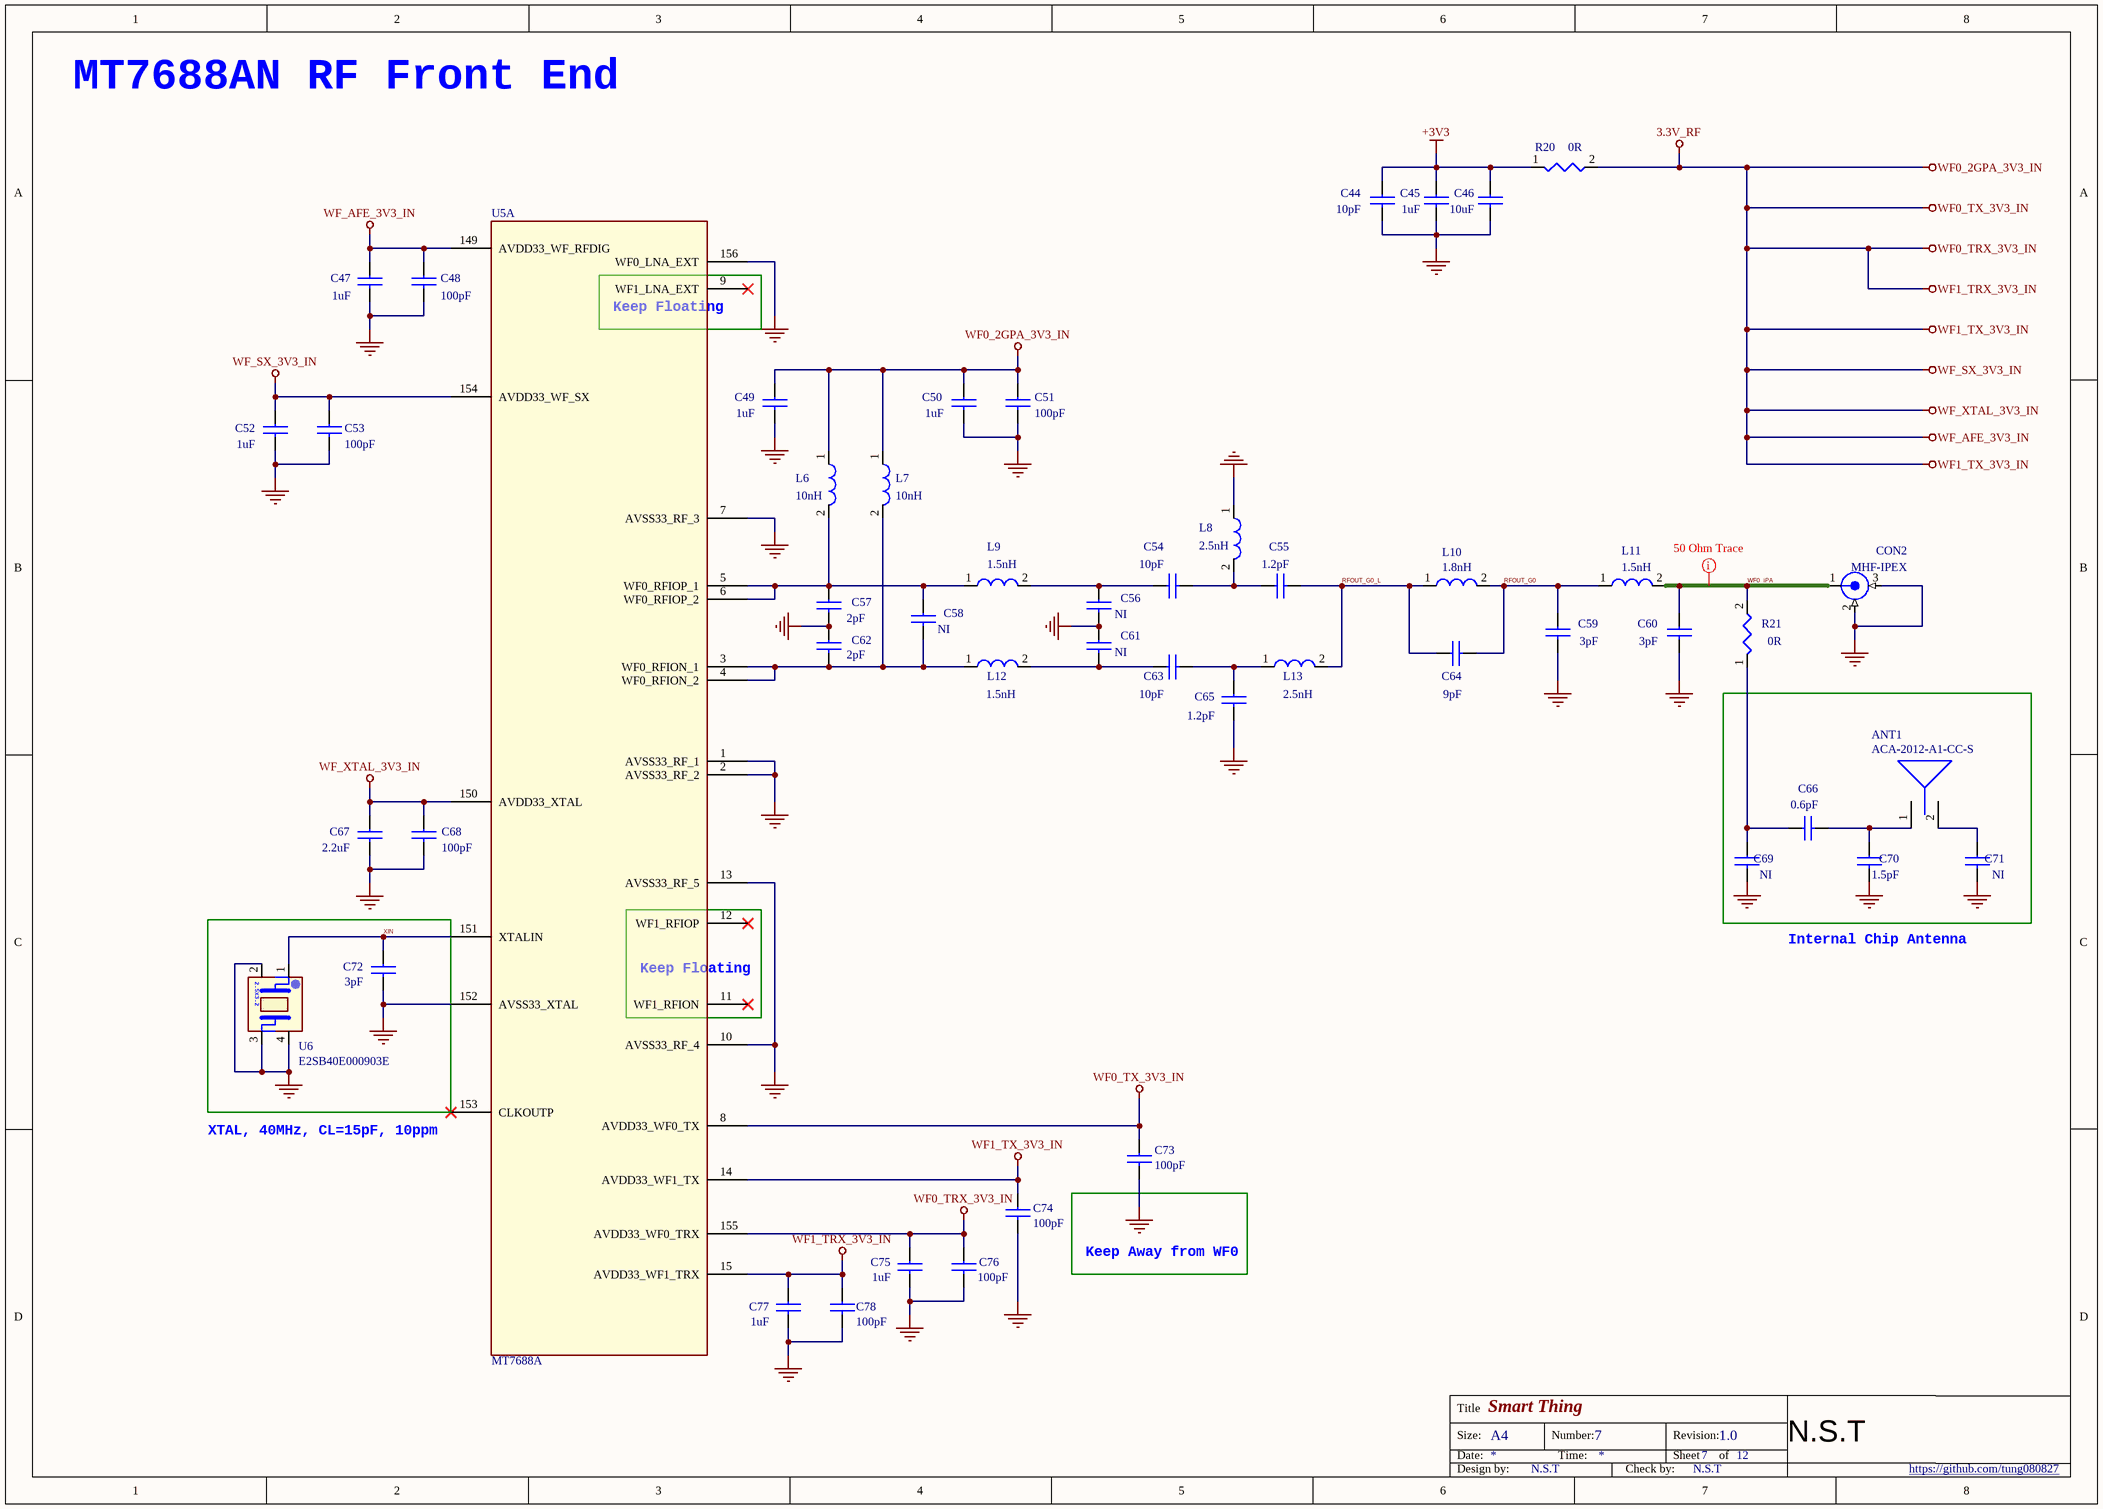
[diagram p6: 07. MT7688AN RF Front End.SchDoc]

### Parts
ANT1  ACA-2012-A1-CC-S  [ACA-2012A]
C44  10pF  [CAPC1005X60X30NL05T10]
C45  1uF  [CAPC1608X90X35NL10T15]
C46  10uF  [CAPC1608X90X35NL10T15]
C47  1uF  [CAPC1608X90X35NL10T15]
C48  100pF  [CAPC1005X60X30NL05T10]
C49  1uF  [CAPC1005X60X30NL05T10]
C50  1uF  [CAPC1005X60X30NL05T10]
C51  100pF  [CAPC1005X60X30NL05T10]
C52  1uF  [CAPC1608X90X35NL10T15]
C53  100pF  [CAPC1005X60X30NL05T10]
C54  10pF  [CAPC1005X60X30NL05T10]
C55  1.2pF  [CAPC1005X60X30NL05T10]
C56  NI  [CAPC1005X60X30NL05T10]
C57  2pF  [CAPC1005X60X30NL05T10]
C58  NI  [CAPC1005X60X30NL05T10]
C59  3pF  [CAPC1005X60X30NL05T10]
C60  3pF  [CAPC1005X60X30NL05T10]
C61  NI  [CAPC1005X60X30NL05T10]
C62  2pF  [CAPC1005X60X30NL05T10]
C63  10pF  [CAPC1005X60X30NL05T10]
C64  9pF  [CAPC1005X60X30NL05T10]
C65  1.2pF  [CAPC1005X60X30NL05T10]
C66  0.6pF  [CAPC1005X60X30NL05T10]
C67  2.2uF  [CAPC1608X90X35NL10T15]
C68  100pF  [CAPC1005X60X30NL05T10]
C69  NI  [CAPC1005X60X30NL05T10]
C70  1.5pF  [CAPC1005X60X30NL05T10]
C71  NI  [CAPC1005X60X30NL05T10]
C72  3pF  [CAPC1005X60X30NL05T10]
C73  100pF  [CAPC1005X60X30NL05T10]
C74  100pF  [CAPC1005X60X30NL05T10]
C75  1uF  [CAPC1608X90X35NL10T15]
C76  100pF  [CAPC1005X60X30NL05T10]
C77  1uF  [CAPC1608X90X35NL10T15]
C78  100pF  [CAPC1005X60X30NL05T10]
CON2  MHF-IPEX  [I-PEX CON]
L6  10nH  [CAPC1005X60X30NL05T10]
L7  10nH  [CAPC1005X60X30NL05T10]
L8  2.5nH  [CAPC1005X60X30NL05T10]
L9  1.5nH  [CAPC1005X60X30NL05T10]
L10  1.8nH  [CAPC1005X60X30NL05T10]
L11  1.5nH  [CAPC1005X60X30NL05T10]
L12  1.5nH  [CAPC1005X60X30NL05T10]
L13  2.5nH  [CAPC1005X60X30NL05T10]
R20  0R  [RESC1609X50X30LL10T20]
R21  0R  [RESC1005X40X25NL05T05]
U5  MT7688A  [MT7628AN12X12]  (part A of 6)
U6  E2SB40E000903E  [XTAL 2520]

### Nets
3.3V_RF: C47.1 C48.1 C49.1 C50.1 C51.1 C52.1 C53.1 C67.1 C68.1 C73.1 C74.1 C75.1 C76.1 C77.1 C78.1 L6.1 L7.1 R20.2 U5.8(AVDD33_WF0_TX) U5.14(AVDD33_WF1_TX) U5.15(AVDD33_WF1_TRX) U5.149(AVDD33_WF_RFDIG) U5.150(AVDD33_XTAL) U5.154(AVDD33_WF_SX) U5.155(AVDD33_WF0_TRX)  [also labelled WF0_2GPA_3V3_IN, WF0_TRX_3V3_IN, WF0_TX_3V3_IN, WF1_TRX_3V3_IN, WF1_TX_3V3_IN, WF_AFE_3V3_IN, WF_SX_3V3_IN, WF_XTAL_3V3_IN]
+3V3: C44.1 C45.1 C46.1 R20.1
GND: C44.2 C45.2 C46.2 C47.2 C48.2 C49.2 C50.2 C51.2 C52.2 C53.2 C56.2 C57.2 C59.2 C60.2 C61.1 C62.1 C65.2 C67.2 C68.2 C69.2 C70.2 C71.2 C72.2 C73.2 C74.2 C75.2 C76.2 C77.2 C78.2 CON2.2 CON2.3(GNDA) L8.1 U5.1(AVSS33_RF_1) U5.2(AVSS33_RF_2) U5.7(AVSS33_RF_3) U5.10(AVSS33_RF_4) U5.13(AVSS33_RF_5) U5.152(AVSS33_XTAL) U5.156(WF0_LNA_EXT) U6.2(NC) U6.3(X2) U6.4(NC)
RFOUT_G0: C59.1 C64.2 L10.2 L11.1
RFOUT_G0_L: C55.2 C64.1 L10.1 L13.2
WF0_iPA: C60.1 CON2.1 L11.2 R21.2
XIN: C72.1 U5.151(XTALIN) U6.1(X1)
NetANT1_1: ANT1.1(IN) C66.2 C70.1
NetANT1_2: ANT1.2(OUT) C71.1
NetC54_1: C54.1 C56.1 L9.2
NetC54_2: C54.2 C55.1 L8.2
NetC57_1: C57.1 C58.1 L6.2 L9.1 U5.5(WF0_RFIOP_1) U5.6(WF0_RFIOP_2)
NetC58_2: C58.2 C62.2 L7.2 L12.1 U5.3(WF0_RFION_1) U5.4(WF0_RFION_2)
NetC61_2: C61.2 C63.1 L12.2
NetC63_2: C63.2 C65.1 L13.1
NetC66_1: C66.1 C69.1 R21.1

Not connected (* = marked no-connect by the designer): U5 9(WF1_LNA_EXT)* 11(WF1_RFION)* 12(WF1_RFIOP)* 153(CLKOUTP)*

### Layout directives
mark named 50 Ohm Trace: WF0_iPA

### Notes on the sheet
- MT7688AN RF Front End
- (near U5) Keep Floating
- Internal Chip Antenna
- XTAL, 40MHz, CL=15pF, 10ppm
- Keep Away from WF0
- Title
- Size:
- Date:
- A4
- Number:
- Time:
- Revision:
- Sheet
- of
- N.S.T
- Design by:
- Check by:
- https://github.com/tung080827
- (in symbol XTAL_3.2x2.5) 2.5x3.2

### Library data of the parts
ANT1 = Antenna_2012
C44-C78 = CAP NP
CON2 = SMA/UFLR
L6-L8 L10 L13 = L/0402
L9 L11 L12 = L/0402: LQP03TN1N5B02D
R20 R21 = RES/0402_3
U5 = MT7620N-n_26
U6 = XTAL_3.2x2.5: XTAL, 40MHz, CL=15pF, 10ppm, -30~+85C

## Sheet 08. MT7688AN DDR2.SchDoc
size A2; DocumentNumber: 8; SheetNumber: 8; SheetTotal: 12
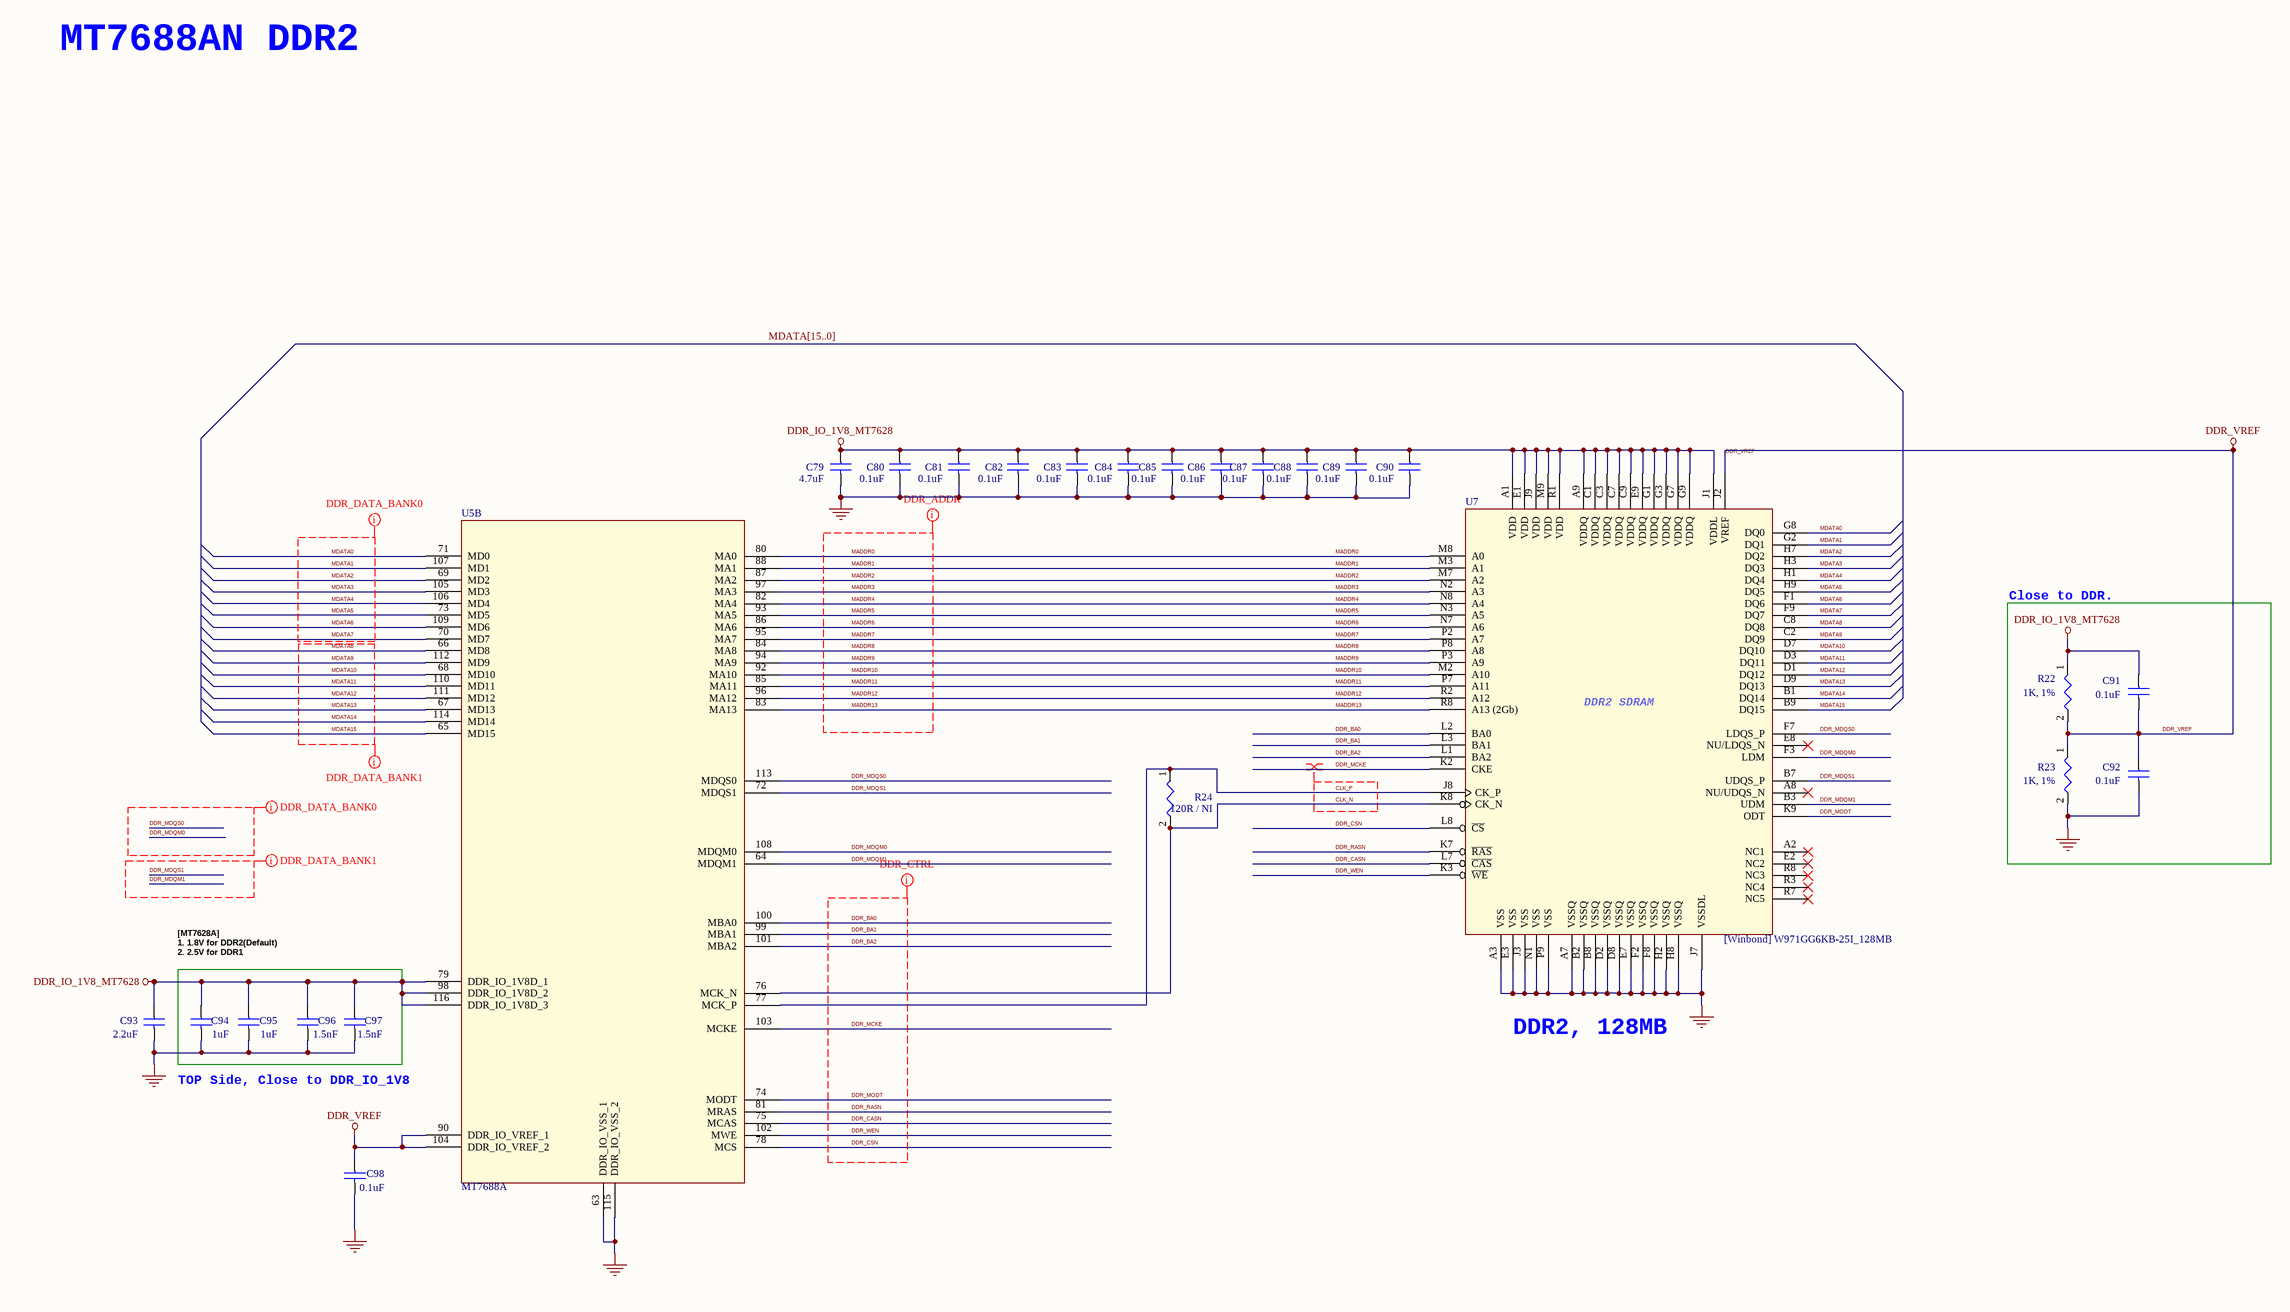
[diagram p7: 08. MT7688AN DDR2.SchDoc]

### Parts
C79  4.7uF  [CAPC1608X90X35NL10T15]
C80  0.1uF  [CAPC1005X60X30NL05T10]
C81  0.1uF  [CAPC1005X60X30NL05T10]
C82  0.1uF  [CAPC1005X60X30NL05T10]
C83  0.1uF  [CAPC1005X60X30NL05T10]
C84  0.1uF  [CAPC1005X60X30NL05T10]
C85  0.1uF  [CAPC1005X60X30NL05T10]
C86  0.1uF  [CAPC1005X60X30NL05T10]
C87  0.1uF  [CAPC1005X60X30NL05T10]
C88  0.1uF  [CAPC1005X60X30NL05T10]
C89  0.1uF  [CAPC1005X60X30NL05T10]
C90  0.1uF  [CAPC1005X60X30NL05T10]
C91  0.1uF  [CAPC1005X60X30NL05T10]
C92  0.1uF  [CAPC1005X60X30NL05T10]
C93  2.2uF  [CAPC1608X90X35NL10T15]
C94  1uF  [CAPC1608X90X35NL10T15]
C95  1uF  [CAPC1608X90X35NL10T15]
C96  1.5nF  [CAPC1005X60X30NL05T10]
C97  1.5nF  [CAPC1005X60X30NL05T10]
C98  0.1uF  [CAPC1005X60X30NL05T10]
R22  1K, 1%  [RESC1005X35X25NL10T10]
R23  1K, 1%  [RESC1005X35X25NL10T10]
R24  120R / NI  [RLC 0201 M35]
U5  MT7688A  [MT7628AN$2F$DRQFN156$2F$SMD$2F$P0.5$2F$12X12]  (part B of 6)
U7  [Winbond] W971GG6KB-25I_128MB  [BGA84C80P9X15X12X8]

### Blocks framed on the sheet
Close to DDR.: C91 C92 R22 R23

### Nets
DDR_IO_1V8_MT7628: C79.1 C80.1 C81.1 C82.1 C83.1 C84.1 C85.1 C86.1 C87.1 C88.1 C89.1 C90.1 C91.1 C93.1 C94.1 C95.1 C96.1 C97.1 R22.1 U5.79(DDR_IO_1V8D_1) U5.98(DDR_IO_1V8D_2) U5.116(DDR_IO_1V8D_3) U7.A1(VDD) U7.A9(VDDQ) U7.C1(VDDQ) U7.C3(VDDQ) U7.C7(VDDQ) U7.C9(VDDQ) U7.E1(VDD) U7.E9(VDDQ) U7.G1(VDDQ) U7.G3(VDDQ) U7.G7(VDDQ) U7.G9(VDDQ) U7.J1(VDDL) U7.J9(VDD) U7.M9(VDD) U7.R1(VDD)
DDR_VREF: C91.2 C92.1 C98.1 R22.2 R23.1 U5.90(DDR_IO_VREF_1) U5.104(DDR_IO_VREF_2) U7.J2(VREF)
GND: C79.2 C80.2 C81.2 C82.2 C83.2 C84.2 C85.2 C86.2 C87.2 C88.2 C89.2 C90.2 C92.2 C93.2 C94.2 C95.2 C96.2 C97.2 C98.2 R23.2 U5.63(DDR_IO_VSS_1) U5.115(DDR_IO_VSS_2) U7.A3(VSS) U7.A7(VSSQ) U7.B2(VSSQ) U7.B8(VSSQ) U7.D2(VSSQ) U7.D8(VSSQ) U7.E3(VSS) U7.E7(VSSQ) U7.F2(VSSQ) U7.F8(VSSQ) U7.H2(VSSQ) U7.H8(VSSQ) U7.J3(VSS) U7.J7(VSSDL) U7.N1(VSS) U7.P9(VSS)
CLK_N: R24.2 U5.76(MCK_N) U7.K8(CK_N)
CLK_P: R24.1 U5.77(MCK_P) U7.J8(CK_P)
DDR_BA0: U5.100(MBA0) U7.L2(BA0)
DDR_BA1: U5.99(MBA1) U7.L3(BA1)
DDR_BA2: U5.101(MBA2) U7.L1(BA2)
DDR_CASN: U5.75(MCAS) U7.L7(~{CAS})
DDR_CSN: U5.78(MCS) U7.L8(~{CS})
DDR_MCKE: U5.103(MCKE) U7.K2(CKE)
DDR_MDQM0: U5.108(MDQM0) U7.F3(LDM)
DDR_MDQM1: U5.64(MDQM1) U7.B3(UDM)
DDR_MDQS0: U5.113(MDQS0) U7.F7(LDQS_P)
DDR_MDQS1: U5.72(MDQS1) U7.B7(UDQS_P)
DDR_MODT: U5.74(MODT) U7.K9(ODT)
DDR_RASN: U5.81(MRAS) U7.K7(~{RAS})
DDR_WEN: U5.102(MWE) U7.K3(~{WE})
MADDR0: U5.80(MA0) U7.M8(A0)
MADDR1: U5.88(MA1) U7.M3(A1)
MADDR2: U5.87(MA2) U7.M7(A2)
MADDR3: U5.97(MA3) U7.N2(A3)
MADDR4: U5.82(MA4) U7.N8(A4)
MADDR5: U5.93(MA5) U7.N3(A5)
MADDR6: U5.86(MA6) U7.N7(A6)
MADDR7: U5.95(MA7) U7.P2(A7)
MADDR8: U5.84(MA8) U7.P8(A8)
MADDR9: U5.94(MA9) U7.P3(A9)
MADDR10: U5.92(MA10) U7.M2(A10)
MADDR11: U5.85(MA11) U7.P7(A11)
MADDR12: U5.96(MA12) U7.R2(A12)
MADDR13: U5.83(MA13) U7.R8(A13_(2Gb))
MDATA0: U5.71(MD0) U7.G8(DQ0)
MDATA1: U5.107(MD1) U7.G2(DQ1)
MDATA2: U5.69(MD2) U7.H7(DQ2)
MDATA3: U5.105(MD3) U7.H3(DQ3)
MDATA4: U5.106(MD4) U7.H1(DQ4)
MDATA5: U5.73(MD5) U7.H9(DQ5)
MDATA6: U5.109(MD6) U7.F1(DQ6)
MDATA7: U5.70(MD7) U7.F9(DQ7)
MDATA8: U5.66(MD8) U7.C8(DQ8)
MDATA9: U5.112(MD9) U7.C2(DQ9)
MDATA10: U5.68(MD10) U7.D7(DQ10)
MDATA11: U5.110(MD11) U7.D3(DQ11)
MDATA12: U5.111(MD12) U7.D1(DQ12)
MDATA13: U5.67(MD13) U7.D9(DQ13)
MDATA14: U5.114(MD14) U7.B1(DQ14)
MDATA15: U5.65(MD15) U7.B9(DQ15)

Not connected (* = marked no-connect by the designer): U7 A2(NC1)* A8(NU/UDQS_N)* E2(NC2)* E8(NU/LDQS_N)* R3(NC4)* R7(NC5)*

### Buses and harness runs
bus MDATA[15..0]

### Layout directives
net class DDR_DATA_BANK1; rule Matched Net Lengths [Tolerance = 20mil]: DDR_MDQM1, DDR_MDQS1, MDATA8, MDATA9, MDATA10, MDATA11, MDATA12, MDATA13, MDATA14, MDATA15
net class DDR_DATA_BANK0; rule Matched Net Lengths [Tolerance = 20mil]: DDR_MDQM0, DDR_MDQS0, MDATA0, MDATA1, MDATA2, MDATA3, MDATA4, MDATA5, MDATA6, MDATA7
net class DDR2_CLK; rule Matched Net Lengths [Tolerance = 20mil]: CLK_N, CLK_P
rule Matched Net Lengths [Tolerance = 50mil]; net class DDR2_ADDR_CTRL: DDR_BA0, DDR_BA1, DDR_BA2, DDR_CASN, DDR_CSN, DDR_MCKE, DDR_MODT, DDR_RASN, DDR_WEN, MADDR0, MADDR1, MADDR2, MADDR3, MADDR4, MADDR5, MADDR6, MADDR7, MADDR8, MADDR9, MADDR10, MADDR11, MADDR12, MADDR13

### Notes on the sheet
- MT7688AN DDR2
- [MT7628A]
  1. 1.8V for DDR2(Default)
  2. 2.5V for DDR1
- DDR2, 128MB
- TOP Side, Close to DDR_IO_1V8
- Title
- Size:
- Date:
- Design by:
- A4
- Number:
- Time:
- Check by:
- Revision:
- Sheet
- of
- N.S.T
- https://github.com/tung080827
- (in symbol W971GG6KB-25I) DDR2 SDRAM

### Library data of the parts
C79-C98 = CAP NP
R22-R24 = RES/0402_3
U5 = MT7620N-n_26
U7 = W971GG6KB-25I: DDR2, 128MB

## Sheet 09. MT7688AN Peripheral.SchDoc
size A2; DocumentNumber: 9; SheetNumber: 9; SheetTotal: 12
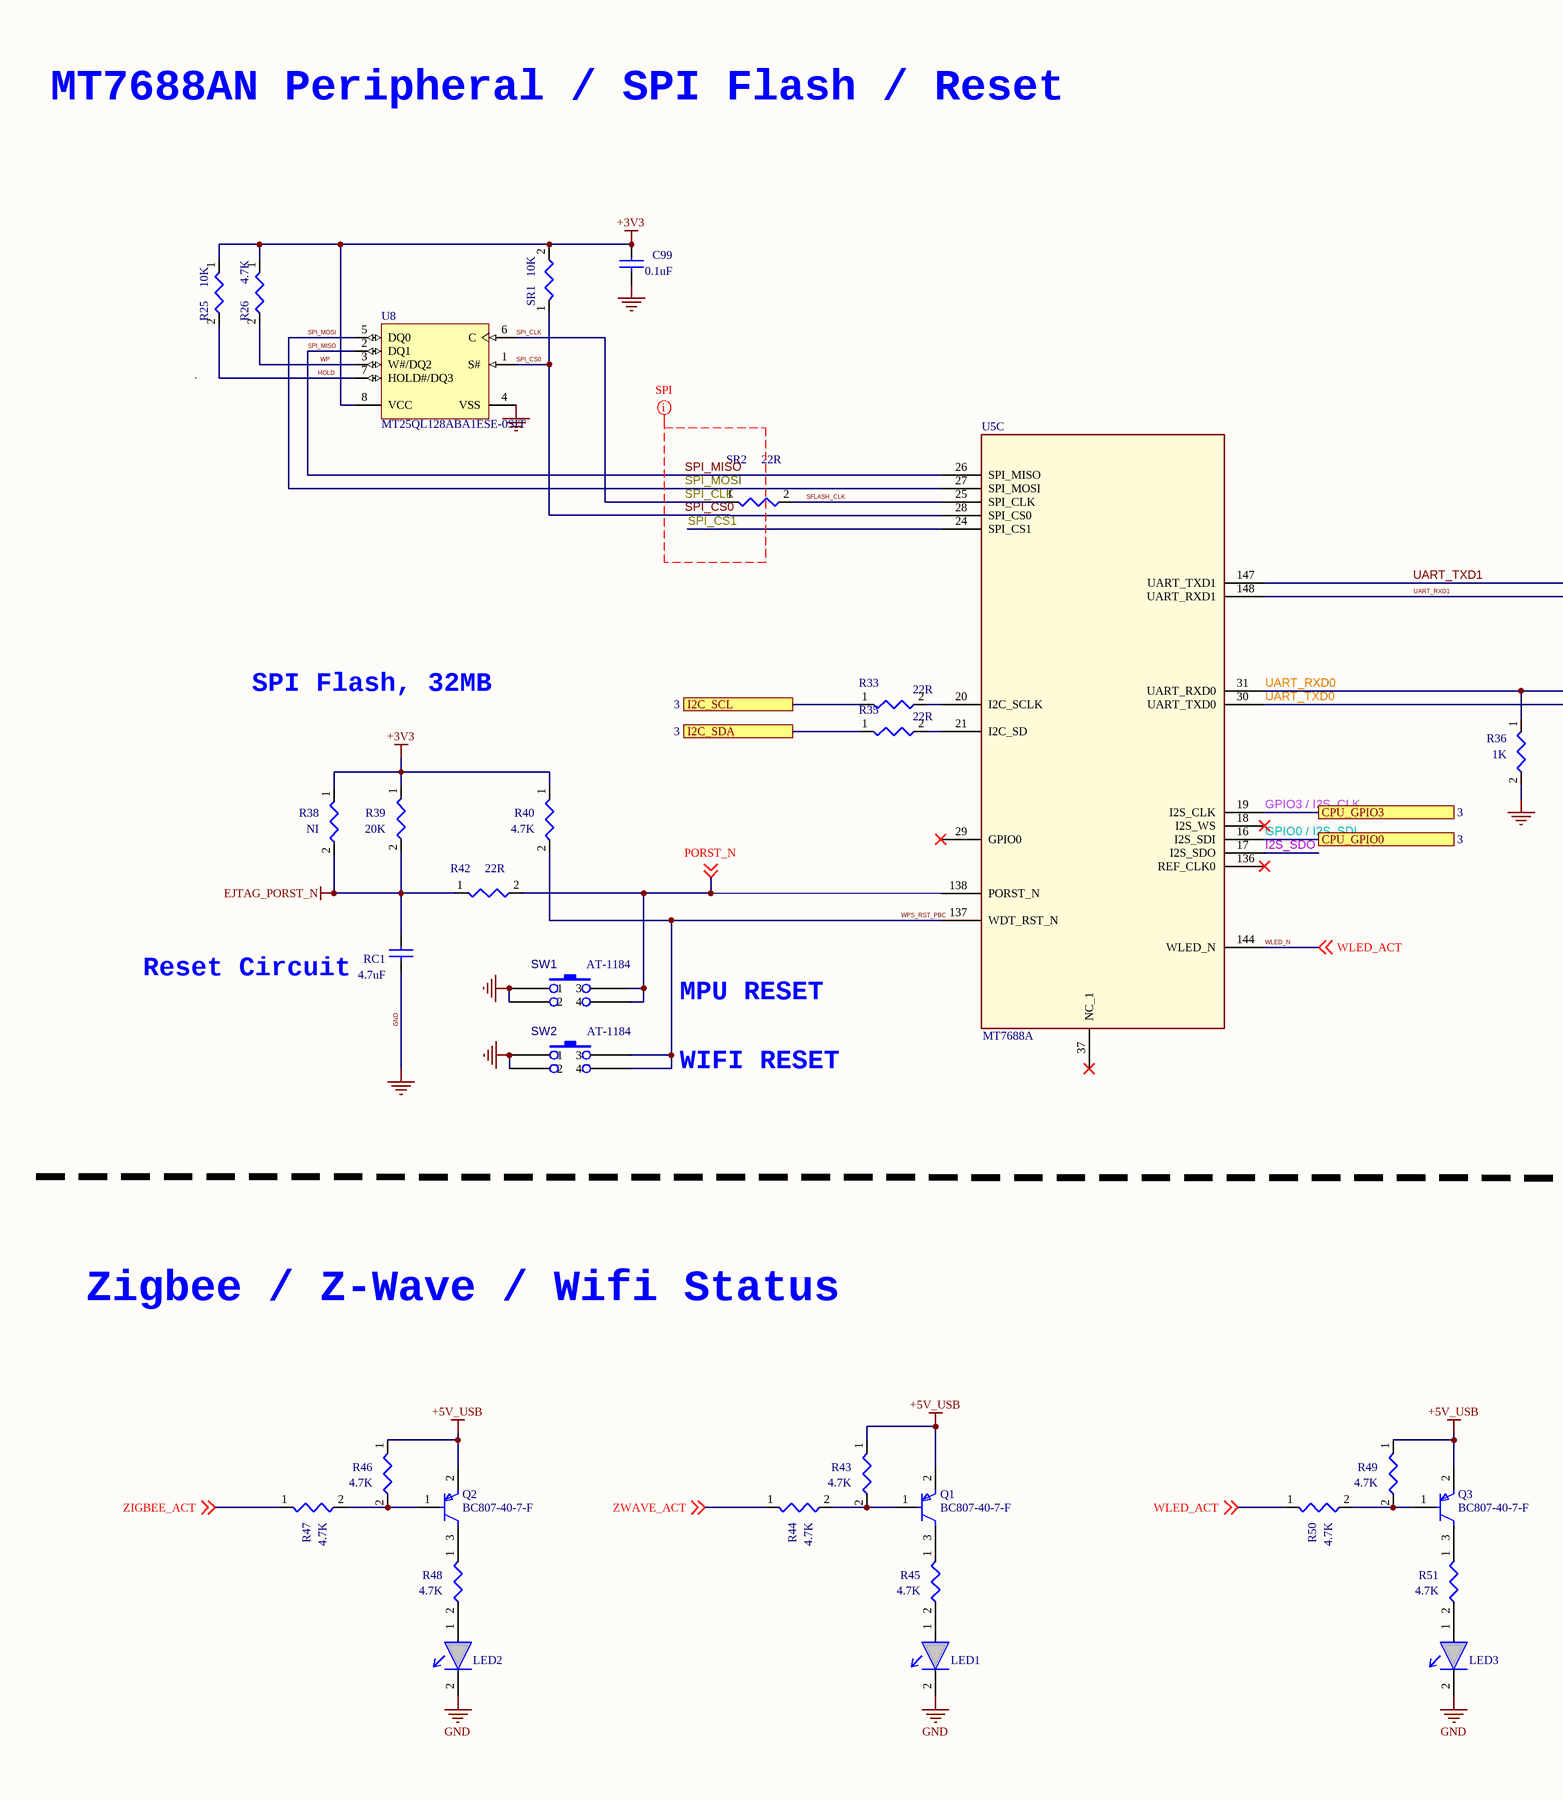
[diagram p8: 09. MT7688AN Peripheral.SchDoc, left]
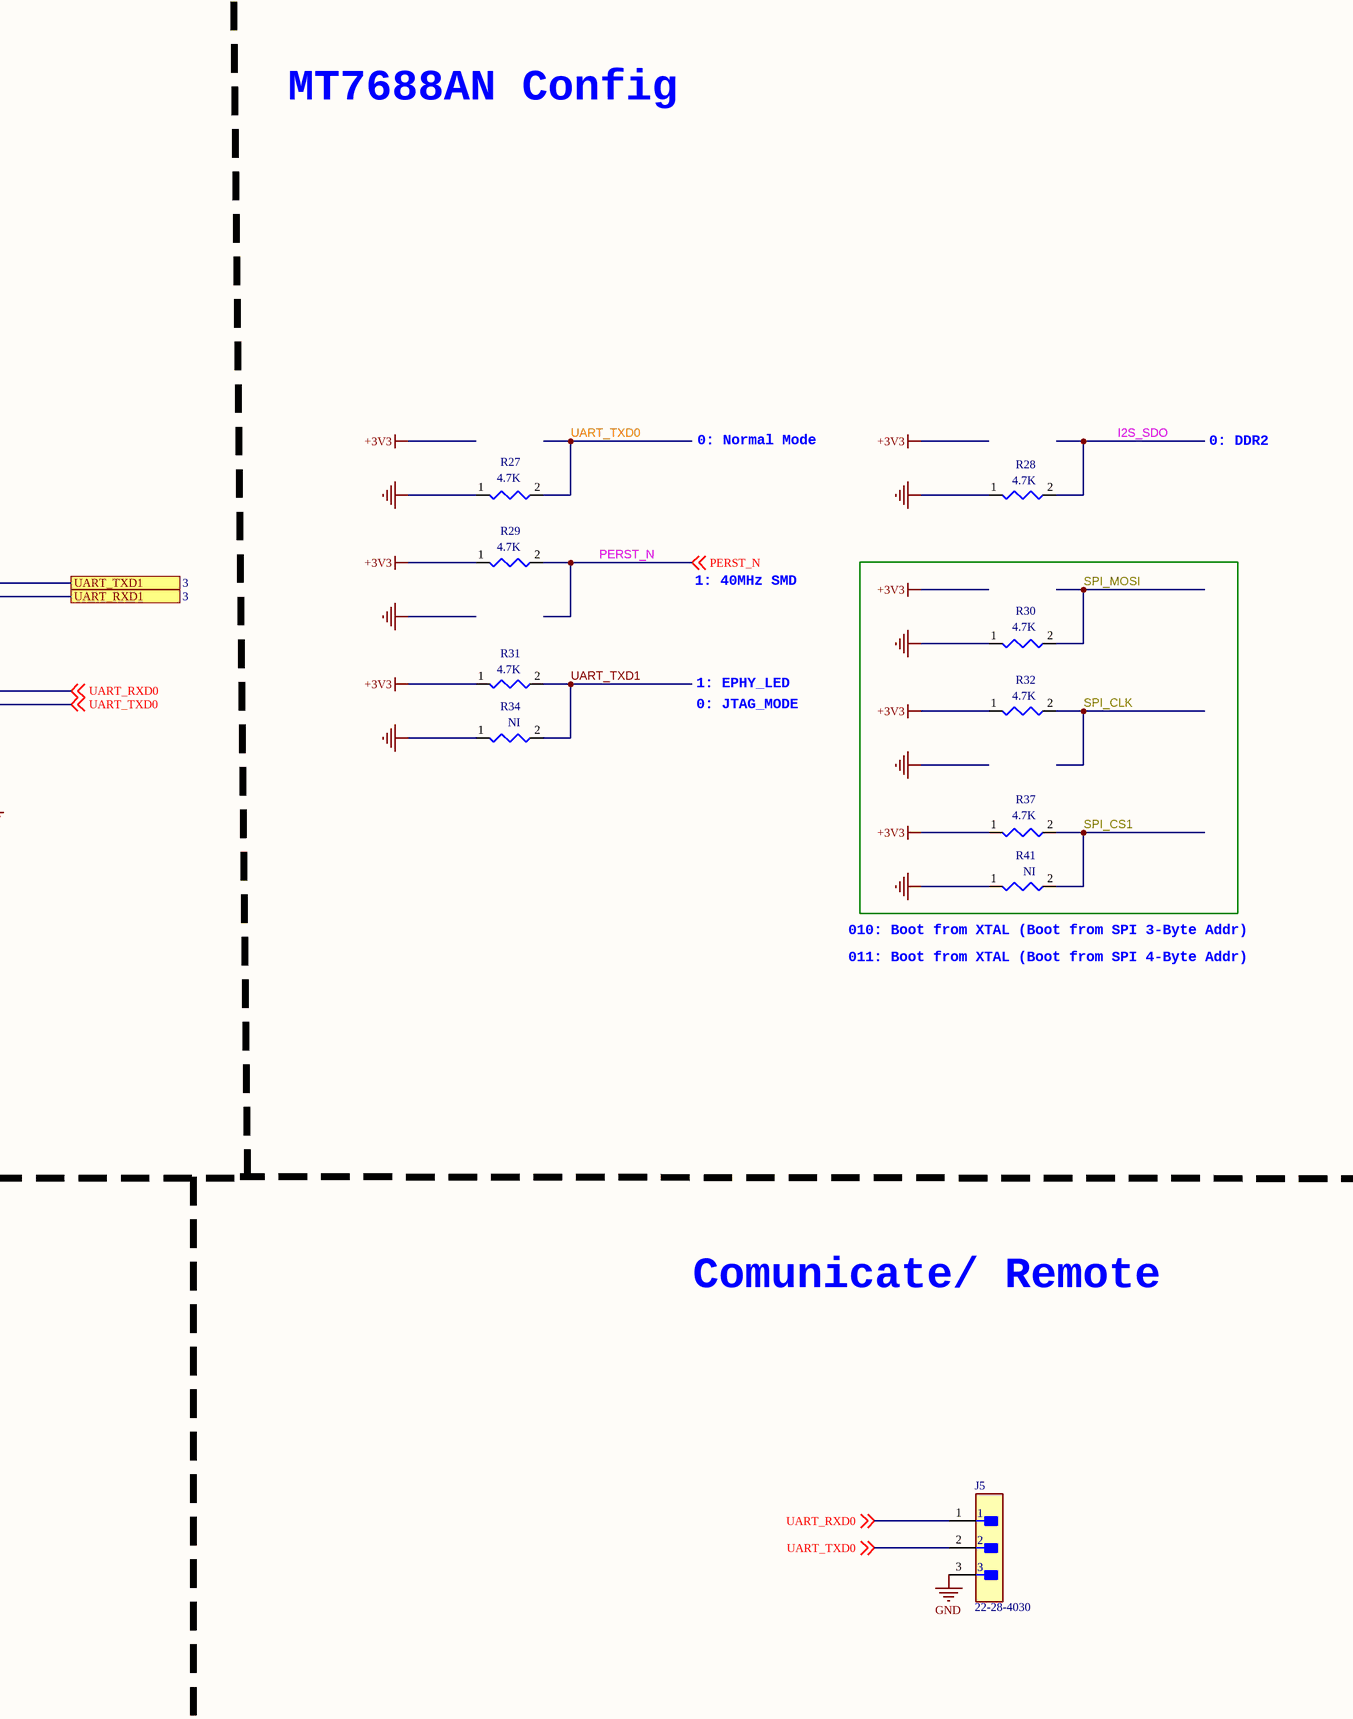
[diagram p9: 09. MT7688AN Peripheral.SchDoc, right]

### Parts
C99  0.1uF  [CAPC1005X60X30NL05T10]
J5  22-28-4030  [FP-22-28-4030-MFG]
LED1  LED 2P  [LED3MM 2P]  (value not drawn)
LED2  LED 2P  [LED3MM 2P]  (value not drawn)
LED3  LED 2P  [LED3MM 2P]  (value not drawn)
Q1  BC807-40-7-F  [FP-SOT23-MFG]
Q2  BC807-40-7-F  [FP-SOT23-MFG]
Q3  BC807-40-7-F  [FP-SOT23-MFG]
R25  10K  [RESC1005X35X25NL10T10]
R26  4.7K  [RESC1005X35X25NL10T10]
R27  4.7K  [RESC1005X35X25NL10T10]
R28  4.7K  [RESC1005X35X25NL10T10]
R29  4.7K  [RESC1005X35X25NL10T10]
R30  4.7K  [RESC1005X35X25NL10T10]
R31  4.7K  [RESC1005X35X25NL10T10]
R32  4.7K  [RESC1005X35X25NL10T10]
R33  22R  [RESC1005X35X25NL10T10]
R34  NI  [RESC1005X35X25NL10T10]
R35  22R  [RESC1005X35X25NL10T10]
R36  1K  [RESC1005X35X25NL10T10]
R37  4.7K  [RESC1005X35X25NL10T10]
R38  NI  [RESC1005X35X25NL10T10]
R39  20K  [RESC1005X35X25NL10T10]
R40  4.7K  [RESC1005X35X25NL10T10]
R41  NI  [RESC1005X35X25NL10T10]
R42  22R  [RESC1005X35X25NL10T10]
R43  4.7K  [RESC1005X35X25NL10T10]
R44  4.7K  [RESC1005X35X25NL10T10]
R45  4.7K  [RESC1609X50X30NL10T20]
R46  4.7K  [RESC1005X35X25NL10T10]
R47  4.7K  [RESC1005X35X25NL10T10]
R48  4.7K  [RESC1609X50X30NL10T20]
R49  4.7K  [RESC1005X35X25NL10T10]
R50  4.7K  [RESC1005X35X25NL10T10]
R51  4.7K  [RESC1609X50X30NL10T20]
RC1  4.7uF  [CAPC1005X60X30NL05T10]
SR1  10K  [RESC1005X35X25NL10T10]
SR2  22R  [RESC1005X35X25NL10T10]
SW1  AT-1184  [AT-1184 SW]
SW2  AT-1184  [AT-1184 SW]
U5  MT7688A  [MT7628AN$2F$DRQFN156$2F$SMD$2F$P0.5$2F$12X12]  (part C of 6)
U8  MT25QL128ABA1ESE-0SIT  [SOIC8_N]

### Ports
CPU_GPIO0 (see 3), CPU_GPIO3 (see 3), I2C_SCL (see 3), I2C_SDA (see 3), UART_RXD1 (see 3), UART_TXD1 (see 3)

### Nets
+3V3: C99.1 R25.1 R26.1 R29.1 R31.1 R32.1 R37.1 R38.1 R39.1 R40.1 SR1.2 U8.8(VCC)
+5V_USB: Q1.2(E) Q2.2(E) Q3.2(E) R43.1 R46.1 R49.1
EJTAG_PORST_N: R38.2 R39.2 R42.1 RC1.1
GND: C99.2 J5.3 LED1.2 LED2.2 LED3.2 R27.1 R28.1 R30.1 R34.1 R36.2 R41.1 RC1.2 SW1.1 SW1.2 SW2.1 SW2.2 U8.4(VSS)
GPIO0 / I2S_SDI: U5.16(I2S_SDI) ; port CPU_GPIO0
GPIO3 / I2S_CLK: U5.19(I2S_CLK) ; port CPU_GPIO3
HOLD: R25.2 U8.7(HOLD#/DQ3)
I2S_SDO: R28.2 U5.17(I2S_SDO)
PERST_N: R29.2 ; off-sheet PERST_N
PORST_N: R42.2 SW1.3 SW1.4 U5.138(PORST_N) ; off-sheet PORST_N
SFLASH_CLK: SR2.2 U5.25(SPI_CLK)
SPI_CLK: R32.2 SR2.1 U8.6(C)
SPI_CS0: SR1.1 U5.28(SPI_CS0) U8.1(S#)
SPI_CS1: R37.2 R41.2 U5.24(SPI_CS1)
SPI_MISO: U5.26(SPI_MISO) U8.2(DQ1)
SPI_MOSI: R30.2 U5.27(SPI_MOSI) U8.5(DQ0)
UART_RXD0: J5.1 R36.1 U5.31(UART_RXD0) ; off-sheet UART_RXD0
UART_RXD1: U5.148(UART_RXD1) ; port UART_RXD1
UART_TXD0: J5.2 R27.2 U5.30(UART_TXD0) ; off-sheet UART_TXD0
UART_TXD1: R31.2 R34.2 U5.147(UART_TXD1) ; port UART_TXD1
WLED_N: R50.1 U5.144(WLED_N) ; off-sheet WLED_ACT  [also labelled WLED_ACT]
WP: R26.2 U8.3(W#/DQ2)
WPS_RST_PBC: R40.2 SW2.3 SW2.4 U5.137(WDT_RST_N)
ZIGBEE_ACT: R47.1 ; off-sheet ZIGBEE_ACT
ZWAVE_ACT: R44.1 ; off-sheet ZWAVE_ACT
NetLED1_1: LED1.1 R45.2
NetLED2_1: LED2.1 R48.2
NetLED3_1: LED3.1 R51.2
NetQ1_1: Q1.1(B) R43.2 R44.2
NetQ1_3: Q1.3(C) R45.1
NetQ2_1: Q2.1(B) R46.2 R47.2
NetQ2_3: Q2.3(C) R48.1
NetQ3_1: Q3.1(B) R49.2 R50.2
NetQ3_3: Q3.3(C) R51.1
NetR33_1: R33.1 ; port I2C_SCL
NetR33_2: R33.2 U5.20(I2C_SCLK)
NetR35_1: R35.1 ; port I2C_SDA
NetR35_2: R35.2 U5.21(I2C_SD)

Not connected (* = marked no-connect by the designer): U5 18(I2S_WS)* 29(GPIO0)* 37(NC_1)* 136(REF_CLK0)*

### Layout directives
net class SPI: SPI_CLK, SPI_CS0, SPI_CS1, SPI_MISO, SPI_MOSI

### Notes on the sheet
- MT7688AN Peripheral / SPI Flash / Reset
- MT7688AN Config
- 0: Normal Mode
- 0: DDR2
- 1: 40MHz SMD
- SPI Flash, 32MB
- 1: EPHY_LED
- 0: JTAG_MODE
- Reset Circuit
- (near R41) 010: Boot from XTAL (Boot from SPI 3-Byte Addr)
- 011: Boot from XTAL (Boot from SPI 4-Byte Addr)
- MPU RESET
- WIFI RESET
- Zigbee / Z-Wave / Wifi Status
- Comunicate/ Remote
- Title
- Size:
- Date:
- Design by:
- A4
- Number:
- Time:
- Check by:
- Revision:
- Sheet
- of
- N.S.T
- https://github.com/tung080827

### Library data of the parts
C99 RC1 = CAP NP
J5 = CMP-04776-000098-1: CONN HEADER VERT 3POS 2.54MM; Manufacturer: Molex; Conn Orientation: Vertical; Conn Gender: Male; Current Rating: 4A; Voltage Rating: 500V; Number Of Contacts: 3; Category: Conn; Number Of Rows: 1; Manufacturer Part Number: 22-28-4030; RoHS: TRUE; Package: 22-28-4030; Footprint Url: https://www.molex.com/pdm_docs/sd/022284030_sd.pdf; ComponentLink2Description: Datasheet; Device Class L2: Headers and Wire Housings; Automotive: No; Temperature Range Low: -40°C; Digikey Description: CONN HEADER VERT 3POS 2.54MM; Mouser Description: Headers & Wire Housings 3P VERT HEADER Sn; Contact Material: Gold,Nickel; Pitch: 2.54mm; Device Class L1: Connectors; Lead Free: Yes; Device Class L3: unset; Temperature Range High: +80°C; Octopart: https://octopart.com/0022284030-molex-10476094; ComponentLink2URL: https://www.molex.com/webdocs/datasheets/pdf/en-us/0022284030_PCB_HEADERS.pdf; Height: 8.88mm; Temperature: -40°C to +80°C
Q1-Q3 = CMP-12798-000025-1: TRANS PNP 45V 0.5A SOT23; Manufacturer: DIODES INC.; Gain Bandwidth Product: 100MHz; Hfe Testic: -100mA; Automotive Grade: Grade 0; Max Junction Temp: +150°C; Hfe Testvce: -1V; Collector Base Voltage: -50V; Collector Emitter Voltage: -45V; Hfe Min: 250; Power Dissipation: 310mW; Rthja Max: 403°C/W; Emitter Base Voltage: -5V; Collector Emitter Saturation Voltage: -0.7V; Hfe Max: 600; Number Of Pnp: 1; Max Collector Current: -0.5A; Standoff Height: 0.013mm; Height: 1.1mm; Octopart: https://octopart.com/bc807-40-7-f-diodes+inc.-354302; Temperature: -55°C to +150°C; Device Class L1: Discrete Semiconductors; Manufacturer Part Number: BC807-40-7-F; Digikey Description: TRANS PNP 45V 0.5A SOT23; Temperature Range High: +150°C; Mouser Description: Bipolar Transistors - BJT PNP BIPOLAR; Temperature Range Low: -55°C; Device Class L2: Transistors; Category: Trans; Device Class L3: BJTs; Automotive: Yes; Package: SOT23; ComponentLink2Description: Datasheet; Ipc Land Pattern Name: SOT92P240X102-3; ComponentLink2URL: https://www.diodes.com/assets/Datasheets/ds11208.pdf; RoHS: TRUE; Footprint Url: https://www.diodes.com/assets/Package-Files/SOT23.pdf; Number Of Elements: 1; Collector Emitter Breakdown Voltage: -45V; Lead Free: Yes
R25-R51 SR1 SR2 = RES/0402_3
SW1 SW2 = SW: TACT Switch, H=1.5mm; Manufacturer: Panasonic - ECG; Manufacturer P/N: EVQ-Q2B01W; Distributor P/N: P12930SCT-ND; Distributor: Digikey
U5 = MT7620N-n_26
U8 = CMP-2000-07468-1: Micron Serial NOR Flash Memory, 2.7 to 3.6 V, 128 Mb, -40 to 85 degC, 8-Pin SOP2 (SE), RoHS, Tape and Reel; Mounting Technology: SurfaceMount; Package Reference: SE-8; Package Description: 8-Pin Small Outline Package, Body 5.285 x 5.285 mm, Pitch 1.27 mm; Manufacturer: Micron; Manufacturer URL: http://www.micron.com/; Datasheet URL: https://www.micron.com/~/media/documents/products/data-sheet/nor-flash/serial-nor/mt25q/die-rev-a/mt25q_qlhs_l_128_aba_0.pdf; Datasheet Version: Rev. I , 09/2016; RoHSCompliant: true

## Sheet 10. MT7688AN USB-PCIe.SchDoc
size A4; DocumentNumber: 10; SheetNumber: 10; SheetTotal: 12
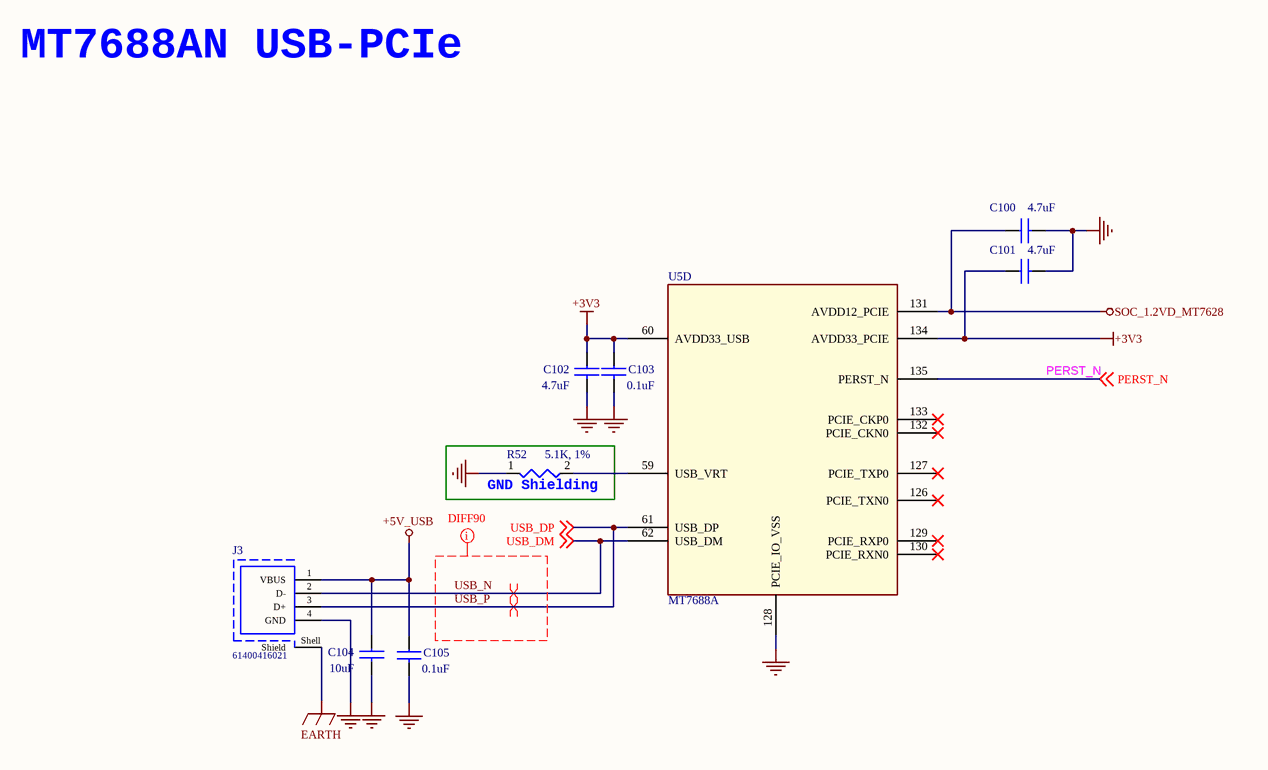
[diagram p10: 10. MT7688AN USB-PCIe.SchDoc]

### Parts
C100  4.7uF  [CAPC1005X60X30LL05T10 - duplicate]
C101  4.7uF  [CAPC1005X60X30LL05T10 - duplicate]
C102  4.7uF  [CAPC1005X60X30NL05T10]
C103  0.1uF  [CAPC1005X60X30NL05T10]
C104  10uF  [CAPC1608X90X35NL10T15]
C105  0.1uF  [CAPC1005X60X30LL05T10 - duplicate]
J3  61400416021  [61400416021]
R52  5.1K, 1%  [RESC1005X40X25NL05T10 - duplicate]
U5  MT7688A  [MT7628AN$2F$DRQFN156$2F$SMD$2F$P0.5$2F$12X12]  (part D of 6)

### Blocks framed on the sheet
GND Shielding: R52

### Nets
+3V3: C101.1 C102.1 C103.1 U5.60(AVDD33_USB) U5.134(AVDD33_PCIE)
+5V_USB: C104.1 C105.1 J3.1(VBUS)
EARTH: J3.Shell(Shield)
GND: C100.2 C101.2 C102.2 C103.2 C104.2 C105.2 J3.4(GND) R52.1 U5.128(PCIE_IO_VSS)
SOC_1.2VD_MT7628: C100.1 U5.131(AVDD12_PCIE)
PERST_N: U5.135(PERST_N) ; off-sheet PERST_N
USB_N: J3.2(D-) U5.62(USB_DM) ; off-sheet USB_DM  [also labelled USB_DM]
USB_P: J3.3(D+) U5.61(USB_DP) ; off-sheet USB_DP  [also labelled USB_DP]
NetR52_2: R52.2 U5.59(USB_VRT)

Not connected (* = marked no-connect by the designer): U5 126(PCIE_TXN0)* 127(PCIE_TXP0)* 129(PCIE_RXP0)* 130(PCIE_RXN0)* 132(PCIE_CKN0)* 133(PCIE_CKP0)*

### Layout directives
net class USB; rule Differential Pairs Routing [Pref Gap = 0.185mm    Min Gap  = 0.1mm    Max Gap  = 0.185mmPref Width = 0.1mm    Min Width  = 0.1mm    Max Width  = 0.1mm]; rule Matched Net Lengths [Tolerance = 20mil]: USB_N, USB_P
differential pair: USB_N, USB_P

### Notes on the sheet
- MT7688AN USB-PCIe
- Title
- Size:
- Date:
- A4
- Number:
- Time:
- Revision:
- Sheet
- of
- N.S.T
- Design by:
- Check by:
- https://github.com/tung080827

### Library data of the parts
C100-C105 = CAP NP
J3 = CMP-1502-03227-1: USB 2.0 Type A Receptacle WR-COM, Horizontal, THT; Manufacturer: Wurth Elektronik; Working Voltage: 30VAC; Rated Current: 1.5A; Contact Resistance: 20mOhm; Manufacturer URL: http://www.we-online.de; Publisher: WurthElektronik; Packaging: Tray; Operating Temperature: -40to105degC; Orientation: Horizontal; Mounting Technology: THT; Part Number: 61400416021; Gender: Receptacle; Package Reference: 61400416021; Connector Type: USB2.0TypeA; Datasheet URL: https://katalog.we-online.de/em/datasheet/61400416021.pdf
R52 = RES/0402_3
U5 = MT7620N-n_26